# EAGLE design track-testing-rev1 (EAGLE 9.6.2)

## Sheet 1 of 4
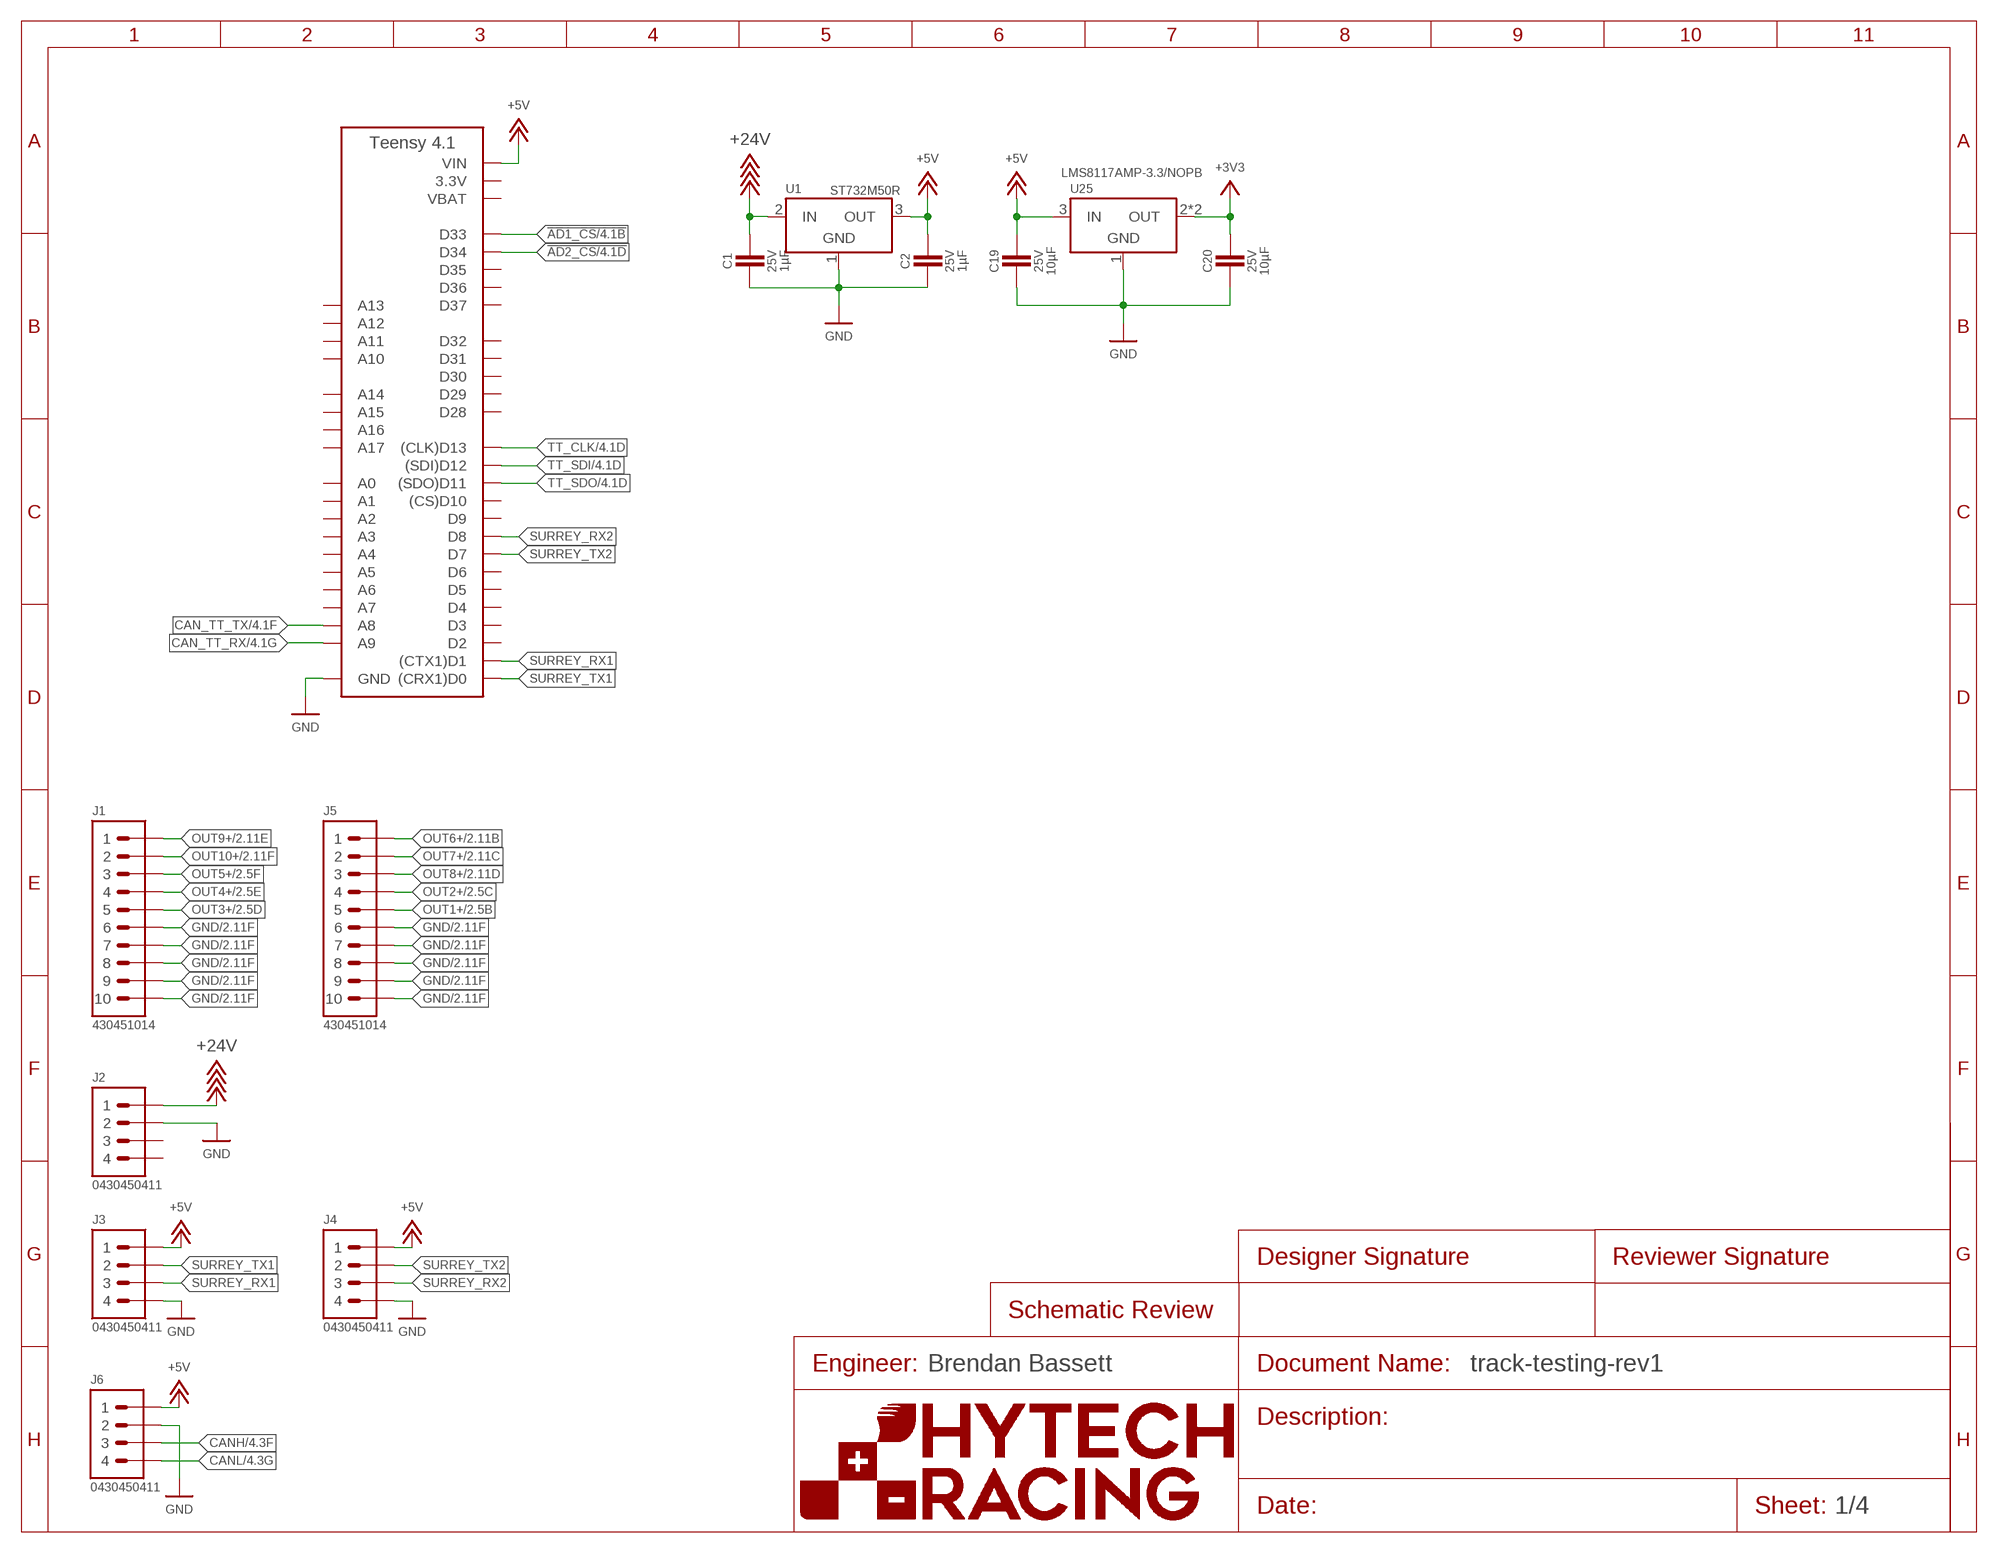
[diagram p0: schematic, sheet 1]
U$6 (FRAME_SCHEMATIC_ONLY): ENGINEER: Brendan Bassett

### Parts
A1  TEENSY_4.1  [TEENSY_LONG_EXT]
C1  CAPACITOR_0603_25V_1UF  [0603-CAP]
C2  CAPACITOR_0603_25V_1UF  [0603-CAP]
C19  CAPACITOR_0603_25V_10UF  [0603-CAP]
C20  CAPACITOR_0603_25V_10UF  [0603-CAP]
J1  CONNECTOR-10_MF_T_V_  [MOLEX_MICROFIT_PTH_VERTICAL_10_DUAL]
J2  CONNECTOR-4_μF_S_RA_  [MOLEX_MICROFIT_SMD_RIGHTANGLE_04_DUAL]
J3  CONNECTOR-4_μF_S_RA_  [MOLEX_MICROFIT_SMD_RIGHTANGLE_04_DUAL]
J4  CONNECTOR-4_μF_S_RA_  [MOLEX_MICROFIT_SMD_RIGHTANGLE_04_DUAL]
J5  CONNECTOR-10_MF_T_V_  [MOLEX_MICROFIT_PTH_VERTICAL_10_DUAL]
J6  CONNECTOR-4_μF_S_RA_  [MOLEX_MICROFIT_SMD_RIGHTANGLE_04_DUAL]
U1  VOLTAGE_REGULATOR_SOT-23-5_5V  [SOT-23-5]
U25  VOLTAGE_REGULATOR_SOT-223_3.3V  [SOT-223]

### Nets
!AD1_CS: A1.D33 ; also sheet 4
!AD2_CS: A1.D34 ; also sheet 4
+3V3: C20.1 U25.2(OUT) U25.4(OUT) ; also sheet 4
+5V: A1.VIN C2.1 C19.1 J3.1 J4.1 J6.1 U1.3(OUT) U25.3(IN) ; also sheet 2,3,4
+24V: C1.1 J2.1 U1.2(IN)
CAN_TT_RX: A1.D23(A9) ; also sheet 4
CAN_TT_TX: A1.D22(A8) ; also sheet 4
CANH: J6.3 ; also sheet 4
CANL: J6.4 ; also sheet 4
GND: A1.AGND/GND(GND) A1.GND A1.GND@2(GND) C1.2 C2.2 C19.2 C20.2 J1.6 J1.7 J1.8 J1.9 J1.10 J2.2 J3.4 J4.4 J5.6 J5.7 J5.8 J5.9 J5.10 J6.2 U1.1(GND) U25.1(GND) ; also sheet 2,3,4
OUT1+: J5.5 ; also sheet 2
OUT2+: J5.4 ; also sheet 2
OUT3+: J1.5 ; also sheet 2
OUT4+: J1.4 ; also sheet 2
OUT5+: J1.3 ; also sheet 2
OUT6+: J5.1 ; also sheet 2
OUT7+: J5.2 ; also sheet 2
OUT8+: J5.3 ; also sheet 2
OUT9+: J1.1 ; also sheet 2
OUT10+: J1.2 ; also sheet 2
SURREY_RX1: A1.D1((CTX1)D1) J3.3
SURREY_RX2: A1.D8 J4.3
SURREY_TX1: A1.D0((CRX1)D0) J3.2
SURREY_TX2: A1.D7 J4.2
TT_CLK: A1.D13((CLK)D13) ; also sheet 4
TT_SDI: A1.D12((SDI)D12) ; also sheet 4
TT_SDO: A1.D11((SDO)D11) ; also sheet 4
Unconnected: A1.D2 A1.D3 A1.D4 A1.D5 A1.D6 A1.D9 A1.D10((CS)D10) A1.D14(A0) A1.D15(A1) A1.D16(A2) A1.D17(A3) A1.D18(A4) A1.D19(A5) A1.D20(A6) A1.D21(A7) A1.D24(A10) A1.D25(A11) A1.D26(A12) A1.D27(A13) A1.D28 A1.D29 A1.D30 A1.D31 A1.D32 A1.D35 A1.D36 A1.D37 A1.D38(A14) A1.D39(A15) A1.D40(A16) A1.D41(A17) J2.3 J2.4

## Sheet 2 of 4
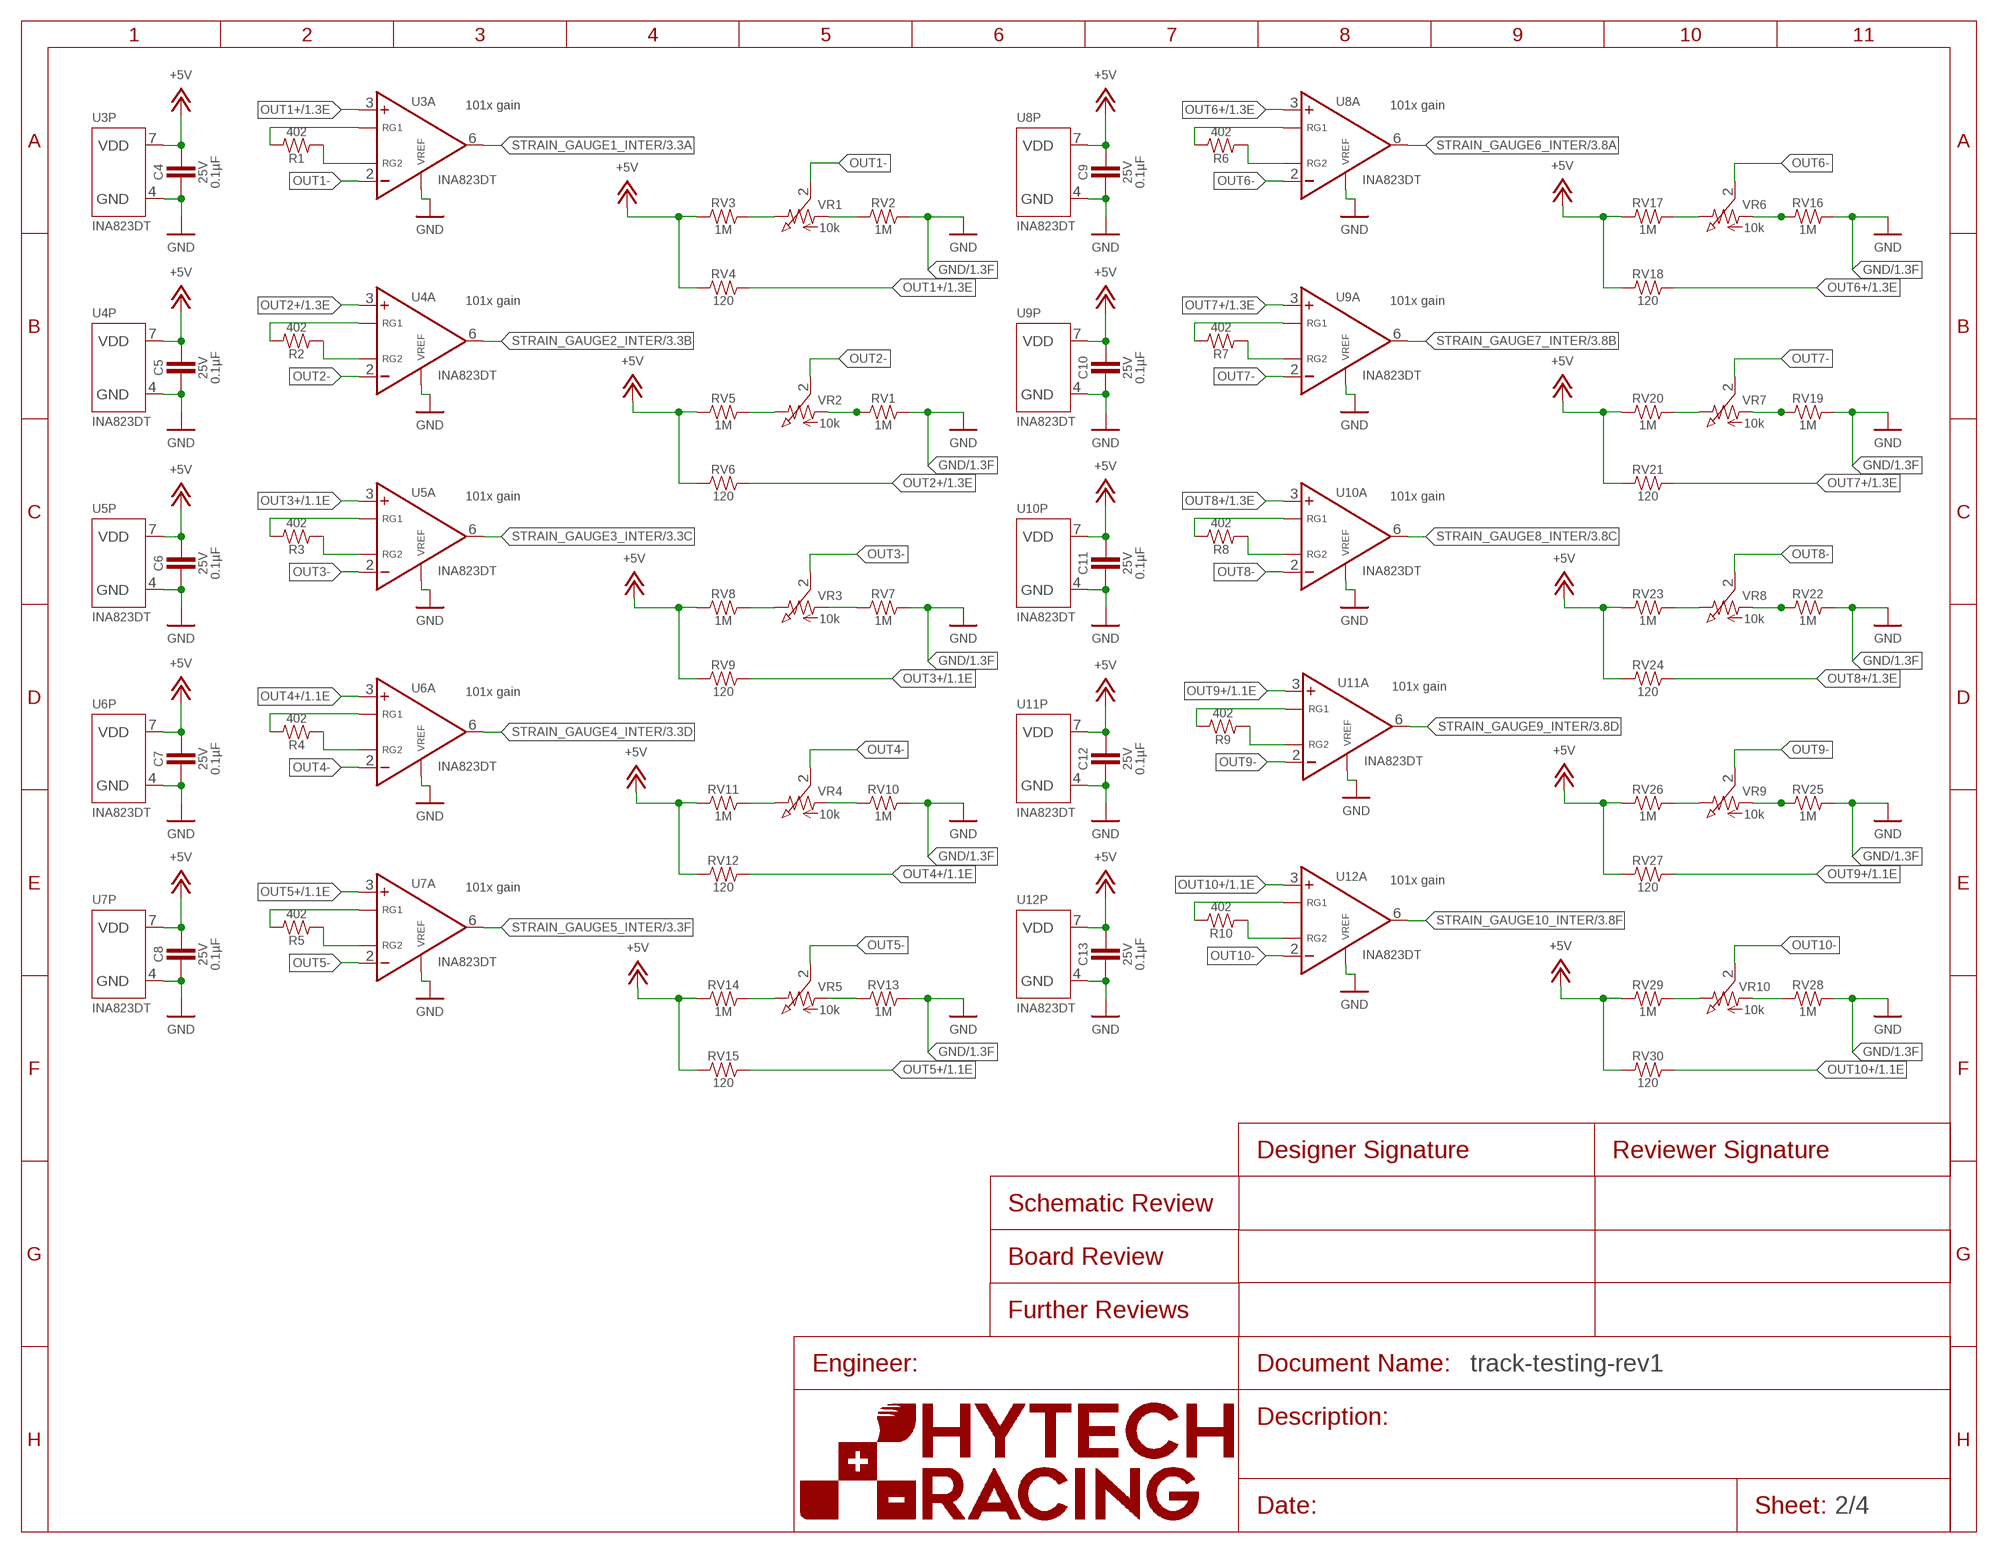
[diagram p1: schematic, sheet 2]

### Parts
C4  CAPACITOR_0603_25V_0.1UF  [0603-CAP]
C5  CAPACITOR_0603_25V_0.1UF  [0603-CAP]
C6  CAPACITOR_0603_25V_0.1UF  [0603-CAP]
C7  CAPACITOR_0603_25V_0.1UF  [0603-CAP]
C8  CAPACITOR_0603_25V_0.1UF  [0603-CAP]
C9  CAPACITOR_0603_25V_0.1UF  [0603-CAP]
C10  CAPACITOR_0603_25V_0.1UF  [0603-CAP]
C11  CAPACITOR_0603_25V_0.1UF  [0603-CAP]
C12  CAPACITOR_0603_25V_0.1UF  [0603-CAP]
C13  CAPACITOR_0603_25V_0.1UF  [0603-CAP]
R1  RESISTOR_0603_402  [0603-RES]
R2  RESISTOR_0603_402  [0603-RES]
R3  RESISTOR_0603_402  [0603-RES]
R4  RESISTOR_0603_402  [0603-RES]
R5  RESISTOR_0603_402  [0603-RES]
R6  RESISTOR_0603_402  [0603-RES]
R7  RESISTOR_0603_402  [0603-RES]
R8  RESISTOR_0603_402  [0603-RES]
R9  RESISTOR_0603_402  [0603-RES]
R10  RESISTOR_0603_402  [0603-RES]
RV1  1M  RESISTOR_0603_1M  [0603-RES]
RV2  1M  RESISTOR_0603_1M  [0603-RES]
RV3  1M  RESISTOR_0603_1M  [0603-RES]
RV4  120  RESISTOR_0603_120  [0603-RES]
RV5  1M  RESISTOR_0603_1M  [0603-RES]
RV6  120  RESISTOR_0603_120  [0603-RES]
RV7  1M  RESISTOR_0603_1M  [0603-RES]
RV8  1M  RESISTOR_0603_1M  [0603-RES]
RV9  120  RESISTOR_VALUE  [0603-RES]
RV10  1M  RESISTOR_0603_1M  [0603-RES]
RV11  1M  RESISTOR_0603_1M  [0603-RES]
RV12  120  RESISTOR_0603_120  [0603-RES]
RV13  1M  RESISTOR_0603_1M  [0603-RES]
RV14  1M  RESISTOR_0603_1M  [0603-RES]
RV15  120  RESISTOR_0603_120  [0603-RES]
RV16  1M  RESISTOR_0603_1M  [0603-RES]
RV17  1M  RESISTOR_0603_1M  [0603-RES]
RV18  120  RESISTOR_0603_120  [0603-RES]
RV19  1M  RESISTOR_0603_1M  [0603-RES]
RV20  1M  RESISTOR_0603_1M  [0603-RES]
RV21  120  RESISTOR_0603_120  [0603-RES]
RV22  1M  RESISTOR_0603_1M  [0603-RES]
RV23  1M  RESISTOR_0603_1M  [0603-RES]
RV24  120  RESISTOR_0603_120  [0603-RES]
RV25  1M  RESISTOR_0603_1M  [0603-RES]
RV26  1M  RESISTOR_0603_1M  [0603-RES]
RV27  120  RESISTOR_0603_120  [0603-RES]
RV28  1M  RESISTOR_0603_1M  [0603-RES]
RV29  1M  RESISTOR_0603_1M  [0603-RES]
RV30  120  RESISTOR_0603_120  [0603-RES]
U3  INA823DT  [SOIC-08(NARROW,0.15")]
U4  INA823DT  [SOIC-08(NARROW,0.15")]
U5  INA823DT  [SOIC-08(NARROW,0.15")]
U6  INA823DT  [SOIC-08(NARROW,0.15")]
U7  INA823DT  [SOIC-08(NARROW,0.15")]
U8  INA823DT  [SOIC-08(NARROW,0.15")]
U9  INA823DT  [SOIC-08(NARROW,0.15")]
U10  INA823DT  [SOIC-08(NARROW,0.15")]
U11  INA823DT  [SOIC-08(NARROW,0.15")]
U12  INA823DT  [SOIC-08(NARROW,0.15")]
VR1  RESISTOR_TRIMPOT_10K_3362P  [3362P]
VR2  RESISTOR_TRIMPOT_10K_3362P  [3362P]
VR3  RESISTOR_TRIMPOT_10K_3362P  [3362P]
VR4  RESISTOR_TRIMPOT_10K_3362P  [3362P]
VR5  RESISTOR_TRIMPOT_10K_3362P  [3362P]
VR6  RESISTOR_TRIMPOT_10K_3362P  [3362P]
VR7  RESISTOR_TRIMPOT_10K_3362P  [3362P]
VR8  RESISTOR_TRIMPOT_10K_3362P  [3362P]
VR9  RESISTOR_TRIMPOT_10K_3362P  [3362P]
VR10  RESISTOR_TRIMPOT_10K_3362P  [3362P]

### Nets
+5V: C4.1 C5.1 C6.1 C7.1 C8.1 C9.1 C10.1 C11.1 C12.1 C13.1 RV3.1 RV4.1 RV5.1 RV6.1 RV8.1 RV9.1 RV11.1 RV12.1 RV14.1 RV15.1 RV17.1 RV18.1 RV20.1 RV21.1 RV23.1 RV24.1 RV26.1 RV27.1 RV29.1 RV30.1 U3.7(P:VDD) U4.7(P:VDD) U5.7(P:VDD) U6.7(P:VDD) U7.7(P:VDD) U8.7(P:VDD) U9.7(P:VDD) U10.7(P:VDD) U11.7(P:VDD) U12.7(P:VDD) ; also sheet 1,3,4
GND: C4.2 C5.2 C6.2 C7.2 C8.2 C9.2 C10.2 C11.2 C12.2 C13.2 RV1.2 RV2.2 RV7.2 RV10.2 RV13.2 RV16.2 RV19.2 RV22.2 RV25.2 RV28.2 U3.4(P:GND) U3.5(A:VREF) U4.4(P:GND) U4.5(A:VREF) U5.4(P:GND) U5.5(A:VREF) U6.4(P:GND) U6.5(A:VREF) U7.4(P:GND) U7.5(A:VREF) U8.4(P:GND) U8.5(A:VREF) U9.4(P:GND) U9.5(A:VREF) U10.4(P:GND) U10.5(A:VREF) U11.4(P:GND) U11.5(A:VREF) U12.4(P:GND) U12.5(A:VREF) ; also sheet 1,3,4
N$1: R2.2 U4.1(A:RG1)
N$2: R1.2 U3.1(A:RG1)
N$3: R1.1 U3.8(A:RG2)
N$4: R2.1 U4.8(A:RG2)
N$5: R3.2 U5.1(A:RG1)
N$6: R6.2 U8.1(A:RG1)
N$7: R3.1 U5.8(A:RG2)
N$8: R6.1 U8.8(A:RG2)
N$9: R4.2 U6.1(A:RG1)
N$10: R7.2 U9.1(A:RG1)
N$11: R4.1 U6.8(A:RG2)
N$12: R5.2 U7.1(A:RG1)
N$13: R5.1 U7.8(A:RG2)
N$14: R7.1 U9.8(A:RG2)
N$15: R8.2 U10.1(A:RG1)
N$16: R8.1 U10.8(A:RG2)
N$17: R9.2 U11.1(A:RG1)
N$18: R9.1 U11.8(A:RG2)
N$19: R10.2 U12.1(A:RG1)
N$20: R10.1 U12.8(A:RG2)
N$41: RV2.1 VR1.1
N$42: RV3.2 VR1.3
N$44: RV1.1 VR2.1
N$45: RV5.2 VR2.3
N$46: RV11.2 VR4.3
N$47: RV7.1 VR3.1
N$48: RV8.2 VR3.3
N$49: RV10.1 VR4.1
N$50: RV14.2 VR5.3
N$51: RV13.1 VR5.1
N$52: RV16.1 VR6.1
N$53: RV17.2 VR6.3
N$54: RV19.1 VR7.1
N$55: RV20.2 VR7.3
N$56: RV22.1 VR8.1
N$57: RV23.2 VR8.3
N$58: RV25.1 VR9.1
N$59: RV26.2 VR9.3
N$60: RV28.1 VR10.1
N$61: RV29.2 VR10.3
OUT1+: RV4.2 U3.3(A:VIN+) ; also sheet 1
OUT1-: U3.2(A:VIN-) VR1.2
OUT2+: RV6.2 U4.3(A:VIN+) ; also sheet 1
OUT2-: U4.2(A:VIN-) VR2.2
OUT3+: RV9.2 U5.3(A:VIN+) ; also sheet 1
OUT3-: U5.2(A:VIN-) VR3.2
OUT4+: RV12.2 U6.3(A:VIN+) ; also sheet 1
OUT4-: U6.2(A:VIN-) VR4.2
OUT5+: RV15.2 U7.3(A:VIN+) ; also sheet 1
OUT5-: U7.2(A:VIN-) VR5.2
OUT6+: RV18.2 U8.3(A:VIN+) ; also sheet 1
OUT6-: U8.2(A:VIN-) VR6.2
OUT7+: RV21.2 U9.3(A:VIN+) ; also sheet 1
OUT7-: U9.2(A:VIN-) VR7.2
OUT8+: RV24.2 U10.3(A:VIN+) ; also sheet 1
OUT8-: U10.2(A:VIN-) VR8.2
OUT9+: RV27.2 U11.3(A:VIN+) ; also sheet 1
OUT9-: U11.2(A:VIN-) VR9.2
OUT10+: RV30.2 U12.3(A:VIN+) ; also sheet 1
OUT10-: U12.2(A:VIN-) VR10.2
STRAIN_GAUGE1_INTER: U3.6(A:VOUT) ; also sheet 3
STRAIN_GAUGE2_INTER: U4.6(A:VOUT) ; also sheet 3
STRAIN_GAUGE3_INTER: U5.6(A:VOUT) ; also sheet 3
STRAIN_GAUGE4_INTER: U6.6(A:VOUT) ; also sheet 3
STRAIN_GAUGE5_INTER: U7.6(A:VOUT) ; also sheet 3
STRAIN_GAUGE6_INTER: U8.6(A:VOUT) ; also sheet 3
STRAIN_GAUGE7_INTER: U9.6(A:VOUT) ; also sheet 3
STRAIN_GAUGE8_INTER: U10.6(A:VOUT) ; also sheet 3
STRAIN_GAUGE9_INTER: U11.6(A:VOUT) ; also sheet 3
STRAIN_GAUGE10_INTER: U12.6(A:VOUT) ; also sheet 3

### Notes on the sheet
- 101x gain | 101x gain
- 101x gain | 101x gain
- 101x gain | 101x gain
- 101x gain
- 101x gain
- 101x gain
- 101x gain

## Sheet 3 of 4
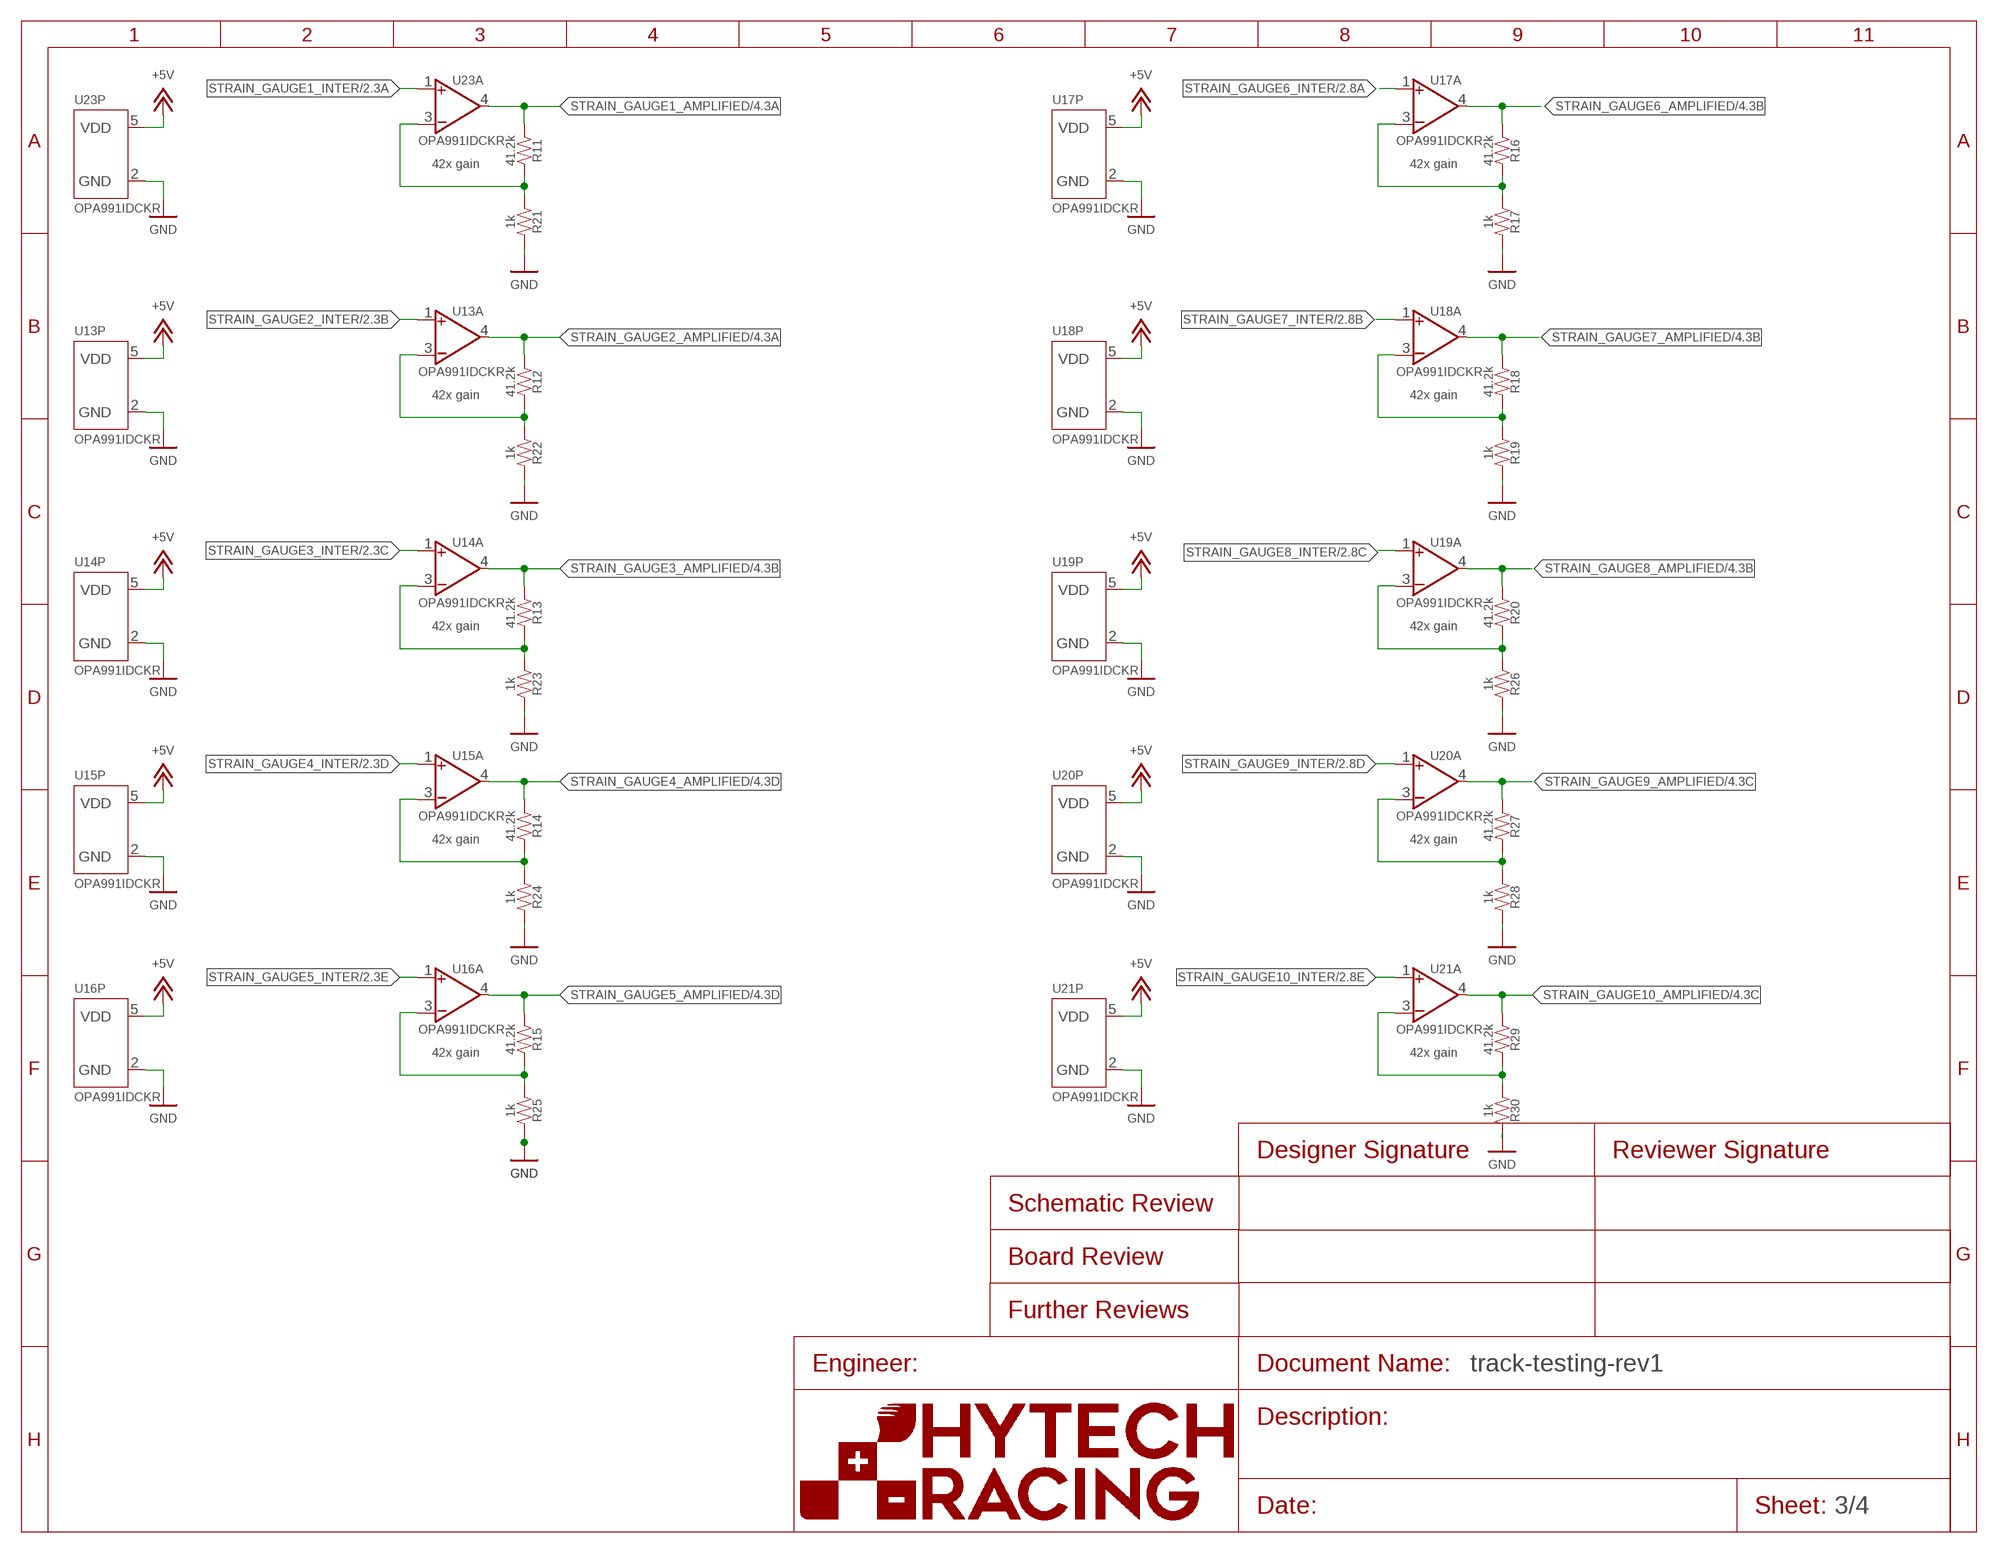
[diagram p2: schematic, sheet 3]

### Parts
R11  RESISTOR_0603_41.2K  [0603-RES]
R12  RESISTOR_0603_41.2K  [0603-RES]
R13  RESISTOR_0603_41.2K  [0603-RES]
R14  RESISTOR_0603_41.2K  [0603-RES]
R15  RESISTOR_0603_41.2K  [0603-RES]
R16  RESISTOR_0603_41.2K  [0603-RES]
R17  RESISTOR_0603_1K  [0603-RES]
R18  RESISTOR_0603_41.2K  [0603-RES]
R19  RESISTOR_0603_1K  [0603-RES]
R20  RESISTOR_0603_41.2K  [0603-RES]
R21  RESISTOR_0603_1K  [0603-RES]
R22  RESISTOR_0603_1K  [0603-RES]
R23  RESISTOR_0603_1K  [0603-RES]
R24  RESISTOR_0603_1K  [0603-RES]
R25  RESISTOR_0603_1K  [0603-RES]
R26  RESISTOR_0603_1K  [0603-RES]
R27  RESISTOR_0603_41.2K  [0603-RES]
R28  RESISTOR_0603_1K  [0603-RES]
R29  RESISTOR_0603_41.2K  [0603-RES]
R30  RESISTOR_0603_1K  [0603-RES]
U13  OPAMP_1_CHANNEL_OPA991  [SC-70-5]
U14  OPAMP_1_CHANNEL_OPA991  [SC-70-5]
U15  OPAMP_1_CHANNEL_OPA991  [SC-70-5]
U16  OPAMP_1_CHANNEL_OPA991  [SC-70-5]
U17  OPAMP_1_CHANNEL_OPA991  [SC-70-5]
U18  OPAMP_1_CHANNEL_OPA991  [SC-70-5]
U19  OPAMP_1_CHANNEL_OPA991  [SC-70-5]
U20  OPAMP_1_CHANNEL_OPA991  [SC-70-5]
U21  OPAMP_1_CHANNEL_OPA991  [SC-70-5]
U23  OPAMP_1_CHANNEL_OPA991  [SC-70-5]

### Nets
+5V: U13.5(P:VDD) U14.5(P:VDD) U15.5(P:VDD) U16.5(P:VDD) U17.5(P:VDD) U18.5(P:VDD) U19.5(P:VDD) U20.5(P:VDD) U21.5(P:VDD) U23.5(P:VDD) ; also sheet 1,2,4
GND: R17.2 R19.2 R21.2 R22.2 R23.2 R24.2 R25.2 R26.2 R28.2 R30.2 U13.2(P:GND) U14.2(P:GND) U15.2(P:GND) U16.2(P:GND) U17.2(P:GND) U18.2(P:GND) U19.2(P:GND) U20.2(P:GND) U21.2(P:GND) U23.2(P:GND) ; also sheet 1,2,4
N$21: R12.2 R22.1 U13.3(A:VIN-)
N$22: R11.2 R21.1 U23.3(A:VIN-)
N$23: R13.2 R23.1 U14.3(A:VIN-)
N$24: R14.2 R24.1 U15.3(A:VIN-)
N$25: R15.2 R25.1 U16.3(A:VIN-)
N$26: R16.2 R17.1 U17.3(A:VIN-)
N$27: R18.2 R19.1 U18.3(A:VIN-)
N$28: R20.2 R26.1 U19.3(A:VIN-)
N$29: R27.2 R28.1 U20.3(A:VIN-)
N$30: R29.2 R30.1 U21.3(A:VIN-)
STRAIN_GAUGE1_AMPLIFIED: R11.1 U23.4(A:VOUT) ; also sheet 4
STRAIN_GAUGE1_INTER: U23.1(A:VIN+) ; also sheet 2
STRAIN_GAUGE2_AMPLIFIED: R12.1 U13.4(A:VOUT) ; also sheet 4
STRAIN_GAUGE2_INTER: U13.1(A:VIN+) ; also sheet 2
STRAIN_GAUGE3_AMPLIFIED: R13.1 U14.4(A:VOUT) ; also sheet 4
STRAIN_GAUGE3_INTER: U14.1(A:VIN+) ; also sheet 2
STRAIN_GAUGE4_AMPLIFIED: R14.1 U15.4(A:VOUT) ; also sheet 4
STRAIN_GAUGE4_INTER: U15.1(A:VIN+) ; also sheet 2
STRAIN_GAUGE5_AMPLIFIED: R15.1 U16.4(A:VOUT) ; also sheet 4
STRAIN_GAUGE5_INTER: U16.1(A:VIN+) ; also sheet 2
STRAIN_GAUGE6_AMPLIFIED: R16.1 U17.4(A:VOUT) ; also sheet 4
STRAIN_GAUGE6_INTER: U17.1(A:VIN+) ; also sheet 2
STRAIN_GAUGE7_AMPLIFIED: R18.1 U18.4(A:VOUT) ; also sheet 4
STRAIN_GAUGE7_INTER: U18.1(A:VIN+) ; also sheet 2
STRAIN_GAUGE8_AMPLIFIED: R20.1 U19.4(A:VOUT) ; also sheet 4
STRAIN_GAUGE8_INTER: U19.1(A:VIN+) ; also sheet 2
STRAIN_GAUGE9_AMPLIFIED: R27.1 U20.4(A:VOUT) ; also sheet 4
STRAIN_GAUGE9_INTER: U20.1(A:VIN+) ; also sheet 2
STRAIN_GAUGE10_AMPLIFIED: R29.1 U21.4(A:VOUT) ; also sheet 4
STRAIN_GAUGE10_INTER: U21.1(A:VIN+) ; also sheet 2

### Notes on the sheet
- 42x gain | 42x gain
- 42x gain | 42x gain
- 42x gain | 42x gain
- 42x gain | 42x gain
- 42x gain | 42x gain

## Sheet 4 of 4
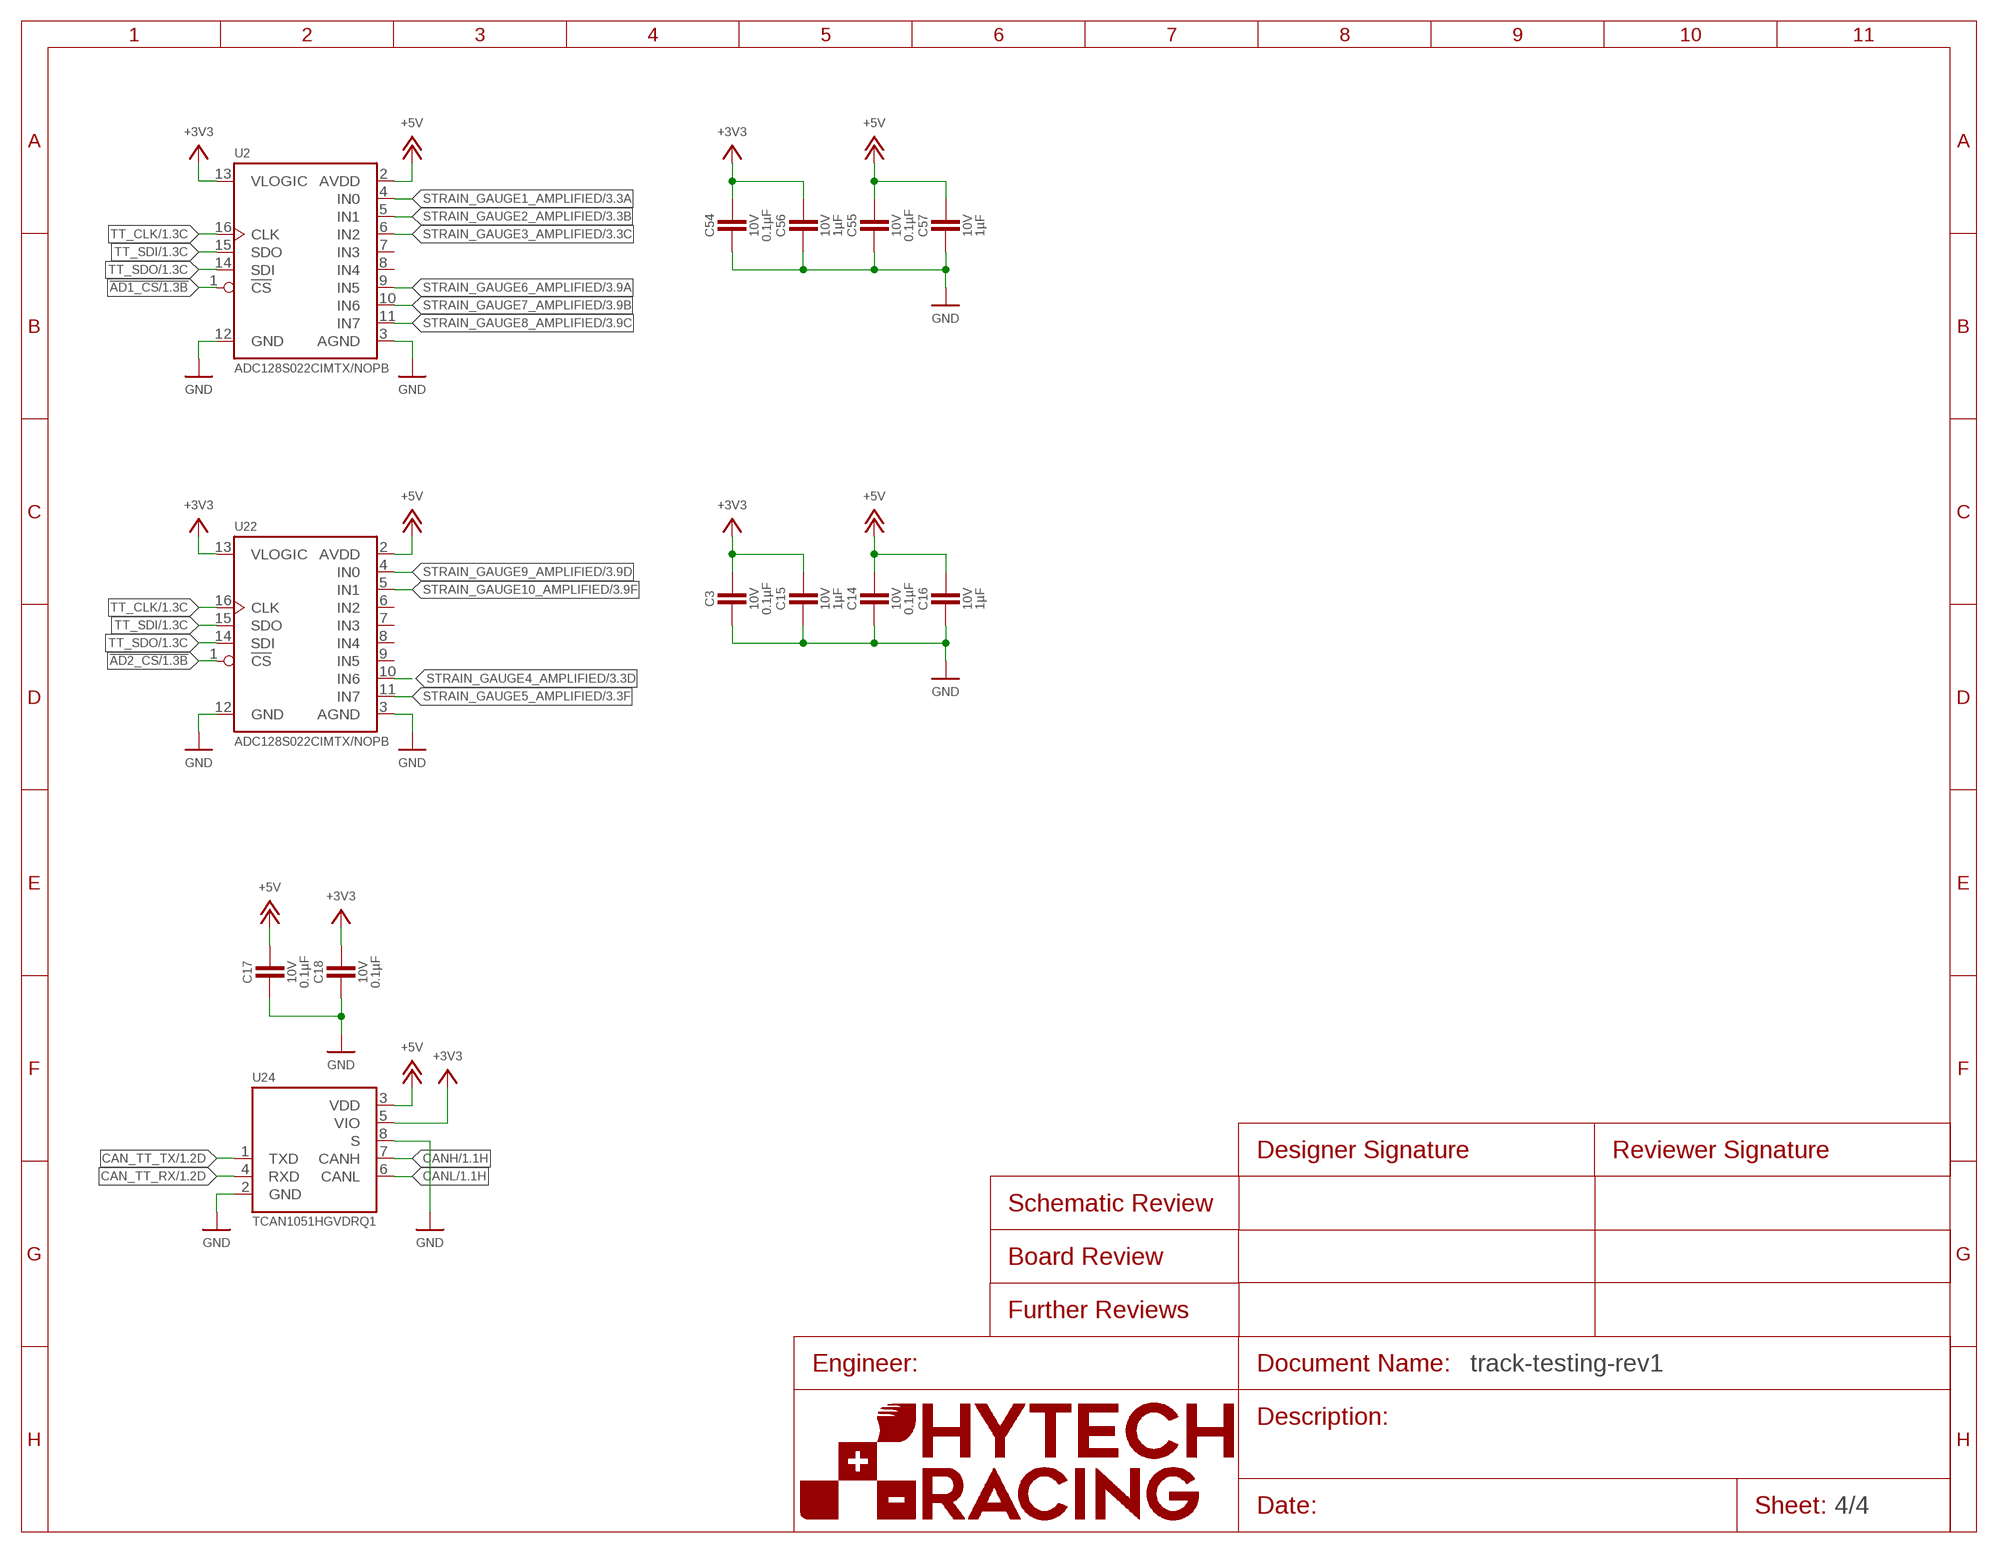
[diagram p3: schematic, sheet 4]

### Parts
C3  CAPACITOR_0603_10V_0.1UF  [0603-CAP]
C14  CAPACITOR_0603_10V_0.1UF  [0603-CAP]
C15  CAPACITOR_0603_10V_1UF  [0603-CAP]
C16  CAPACITOR_0603_10V_1UF  [0603-CAP]
C17  CAPACITOR_0603_10V_0.1UF  [0603-CAP]
C18  CAPACITOR_0603_10V_0.1UF  [0603-CAP]
C54  CAPACITOR_0603_10V_0.1UF  [0603-CAP]
C55  CAPACITOR_0603_10V_0.1UF  [0603-CAP]
C56  CAPACITOR_0603_10V_1UF  [0603-CAP]
C57  CAPACITOR_0603_10V_1UF  [0603-CAP]
U2  ADC128S022  [TSSOP-16]
U22  ADC128S022  [TSSOP-16]
U24  TCAN1051HQV-Q1  [SOIC-08(NARROW,0.15")]

### Nets
!AD1_CS: U2.1(!CS!) ; also sheet 1
!AD2_CS: U22.1(!CS!) ; also sheet 1
+3V3: C3.1 C15.1 C18.1 C54.1 C56.1 U2.13(VLOGIC) U22.13(VLOGIC) U24.5(VIO) ; also sheet 1
+5V: C14.1 C16.1 C17.1 C55.1 C57.1 U2.2(AVDD) U22.2(AVDD) U24.3(VDD) ; also sheet 1,2,3
CAN_TT_RX: U24.4(RXD) ; also sheet 1
CAN_TT_TX: U24.1(TXD) ; also sheet 1
CANH: U24.7(CANH) ; also sheet 1
CANL: U24.6(CANL) ; also sheet 1
GND: C3.2 C14.2 C15.2 C16.2 C17.2 C18.2 C54.2 C55.2 C56.2 C57.2 U2.3(AGND) U2.12(GND) U22.3(AGND) U22.12(GND) U24.2(GND) U24.8(S) ; also sheet 1,2,3
STRAIN_GAUGE1_AMPLIFIED: U2.4(IN0) ; also sheet 3
STRAIN_GAUGE2_AMPLIFIED: U2.5(IN1) ; also sheet 3
STRAIN_GAUGE3_AMPLIFIED: U2.6(IN2) ; also sheet 3
STRAIN_GAUGE4_AMPLIFIED: U22.10(IN6) ; also sheet 3
STRAIN_GAUGE5_AMPLIFIED: U22.11(IN7) ; also sheet 3
STRAIN_GAUGE6_AMPLIFIED: U2.9(IN5) ; also sheet 3
STRAIN_GAUGE7_AMPLIFIED: U2.10(IN6) ; also sheet 3
STRAIN_GAUGE8_AMPLIFIED: U2.11(IN7) ; also sheet 3
STRAIN_GAUGE9_AMPLIFIED: U22.4(IN0) ; also sheet 3
STRAIN_GAUGE10_AMPLIFIED: U22.5(IN1) ; also sheet 3
TT_CLK: U2.16(CLK) U22.16(CLK) ; also sheet 1
TT_SDI: U2.15(SDO) U22.15(SDO) ; also sheet 1
TT_SDO: U2.14(SDI) U22.14(SDI) ; also sheet 1
Unconnected: U2.7(IN3) U2.8(IN4) U22.6(IN2) U22.7(IN3) U22.8(IN4) U22.9(IN5)

## Power pins joined to a net without a drawn wire
3.3V: A1.3V3(3.3V) A1.3V3@2(3.3V) A1.3V3@3(3.3V)
VBAT: A1.VBAT

## Library data of the parts
A1 = HyTechDevices:TEENSY_4.1: Teensy 4.1 with VBAT Datasheet <https://www.pjrc.com/store/teensy41.html#pins> Requires ordering of: 2: 24 pin, 0.1" pitch female headers 1: 2 pin, 0.1" pitch female headers; TEENSY: 4.1
C1 C2 = HyTechDevices:CAPACITOR_?_*: Capacitor, Non-Polarized VJ...1BC Series Datasheet <https://www.mouser.com/datasheet/2/427/vjw1bcbascomseries-1762447.pdf> Samsung Datasheet <https://www.mouser.com/datasheet/2/585/MLCC-1837944.pdf> Walsin Datasheet <https://www.mouser.com/datasheet/2/210/WTC_MLCC_General_Purpose-1534899.pdf> GRM188R61A226ME15D <https://www.mouser.com/datasheet/2/281/1/GRM188R61A226ME15_02A-1985787.pdf> GRM188R61E106MA73D <https://www.mouser.com/datasheet/2/281/1/GRM188R61E106MA73_01A-1985806.pdf> 885012006013 <https://www.mouser.com/datasheet/2/445/885012006013-1726946.pdf> 2220Y6300105KXTWS2 <https://www.mouser.com/datasheet/2/218/SMD_High_and_Std_StackiCap_P62-1825512.pdf> Yageo Class 2, X5R <https://www.mouser.com/datasheet/2/447/UPY_GPHC_X5R_4V_to_50V_26-1827097.pdf> TDK C Series <https://www.mouser.com/ProductDetail/TDK/C3216X5R1V226M160AC?qs=%2Fha2pyFadujbcx9jh7lYl%2F4NeMoXFhdc8AqVWNq4wW6M2y7zl6GzBuhgtI0ngznN> AVX Automotive MLCC <https://www.mouser.com/datasheet/2/40/AutoMLCC-777028.pdf> KEMET X7R Series <https://www.mouser.com/datasheet/2/212/KEM_C1002_X7R_SMD-1102033.pdf> Kyocera AVX <https://www.mouser.com/datasheet/2/40/C0GNP0_Dielectric-951274.pdf> GRM21BR61H <https://www.mouser.com/datasheet/2/281/1/GRM21BR61H106KE43_01A-1986884.pdf>; CAPACITANCE: 1µF; DKPN: 1276-1184-1-ND; MANUFACTURER: Samsung Electro-Mechanics; MOPN: 187-CL10B105KA8NNNC; MPN: CL10B105KA8NNNC; TOLERANCE: 10%; VOLTAGE: 25V
C3 C14 C17 C18 C54 C55 = HyTechDevices:CAPACITOR_?_*: Capacitor, Non-Polarized VJ...1BC Series Datasheet <https://www.mouser.com/datasheet/2/427/vjw1bcbascomseries-1762447.pdf> Samsung Datasheet <https://www.mouser.com/datasheet/2/585/MLCC-1837944.pdf> Walsin Datasheet <https://www.mouser.com/datasheet/2/210/WTC_MLCC_General_Purpose-1534899.pdf> GRM188R61A226ME15D <https://www.mouser.com/datasheet/2/281/1/GRM188R61A226ME15_02A-1985787.pdf> GRM188R61E106MA73D <https://www.mouser.com/datasheet/2/281/1/GRM188R61E106MA73_01A-1985806.pdf> 885012006013 <https://www.mouser.com/datasheet/2/445/885012006013-1726946.pdf> 2220Y6300105KXTWS2 <https://www.mouser.com/datasheet/2/218/SMD_High_and_Std_StackiCap_P62-1825512.pdf> Yageo Class 2, X5R <https://www.mouser.com/datasheet/2/447/UPY_GPHC_X5R_4V_to_50V_26-1827097.pdf> TDK C Series <https://www.mouser.com/ProductDetail/TDK/C3216X5R1V226M160AC?qs=%2Fha2pyFadujbcx9jh7lYl%2F4NeMoXFhdc8AqVWNq4wW6M2y7zl6GzBuhgtI0ngznN> AVX Automotive MLCC <https://www.mouser.com/datasheet/2/40/AutoMLCC-777028.pdf> KEMET X7R Series <https://www.mouser.com/datasheet/2/212/KEM_C1002_X7R_SMD-1102033.pdf> Kyocera AVX <https://www.mouser.com/datasheet/2/40/C0GNP0_Dielectric-951274.pdf> GRM21BR61H <https://www.mouser.com/datasheet/2/281/1/GRM21BR61H106KE43_01A-1986884.pdf>; CAPACITANCE: 0.1µF; DKPN: 720-1688-1-ND; MANUFACTURER: Vishay Vitramon; MOPN: 77-VJ0603Y104JXQPBC; MPN: VJ0603Y104JXQPW1BC; TOLERANCE: 5%; VOLTAGE: 10V
C4-C13 = HyTechDevices:CAPACITOR_?_*: Capacitor, Non-Polarized VJ...1BC Series Datasheet <https://www.mouser.com/datasheet/2/427/vjw1bcbascomseries-1762447.pdf> Samsung Datasheet <https://www.mouser.com/datasheet/2/585/MLCC-1837944.pdf> Walsin Datasheet <https://www.mouser.com/datasheet/2/210/WTC_MLCC_General_Purpose-1534899.pdf> GRM188R61A226ME15D <https://www.mouser.com/datasheet/2/281/1/GRM188R61A226ME15_02A-1985787.pdf> GRM188R61E106MA73D <https://www.mouser.com/datasheet/2/281/1/GRM188R61E106MA73_01A-1985806.pdf> 885012006013 <https://www.mouser.com/datasheet/2/445/885012006013-1726946.pdf> 2220Y6300105KXTWS2 <https://www.mouser.com/datasheet/2/218/SMD_High_and_Std_StackiCap_P62-1825512.pdf> Yageo Class 2, X5R <https://www.mouser.com/datasheet/2/447/UPY_GPHC_X5R_4V_to_50V_26-1827097.pdf> TDK C Series <https://www.mouser.com/ProductDetail/TDK/C3216X5R1V226M160AC?qs=%2Fha2pyFadujbcx9jh7lYl%2F4NeMoXFhdc8AqVWNq4wW6M2y7zl6GzBuhgtI0ngznN> AVX Automotive MLCC <https://www.mouser.com/datasheet/2/40/AutoMLCC-777028.pdf> KEMET X7R Series <https://www.mouser.com/datasheet/2/212/KEM_C1002_X7R_SMD-1102033.pdf> Kyocera AVX <https://www.mouser.com/datasheet/2/40/C0GNP0_Dielectric-951274.pdf> GRM21BR61H <https://www.mouser.com/datasheet/2/281/1/GRM21BR61H106KE43_01A-1986884.pdf>; CAPACITANCE: 0.1µF; DKPN: 1276-1006-1-ND; MANUFACTURER: Samsung Electro-Mechanics; MOPN: 187-CL10B104KA8NNNC; MPN: CL10B104KA8NNNC; TOLERANCE: 10%; VOLTAGE: 25V
C15 C16 C56 C57 = HyTechDevices:CAPACITOR_?_*: Capacitor, Non-Polarized VJ...1BC Series Datasheet <https://www.mouser.com/datasheet/2/427/vjw1bcbascomseries-1762447.pdf> Samsung Datasheet <https://www.mouser.com/datasheet/2/585/MLCC-1837944.pdf> Walsin Datasheet <https://www.mouser.com/datasheet/2/210/WTC_MLCC_General_Purpose-1534899.pdf> GRM188R61A226ME15D <https://www.mouser.com/datasheet/2/281/1/GRM188R61A226ME15_02A-1985787.pdf> GRM188R61E106MA73D <https://www.mouser.com/datasheet/2/281/1/GRM188R61E106MA73_01A-1985806.pdf> 885012006013 <https://www.mouser.com/datasheet/2/445/885012006013-1726946.pdf> 2220Y6300105KXTWS2 <https://www.mouser.com/datasheet/2/218/SMD_High_and_Std_StackiCap_P62-1825512.pdf> Yageo Class 2, X5R <https://www.mouser.com/datasheet/2/447/UPY_GPHC_X5R_4V_to_50V_26-1827097.pdf> TDK C Series <https://www.mouser.com/ProductDetail/TDK/C3216X5R1V226M160AC?qs=%2Fha2pyFadujbcx9jh7lYl%2F4NeMoXFhdc8AqVWNq4wW6M2y7zl6GzBuhgtI0ngznN> AVX Automotive MLCC <https://www.mouser.com/datasheet/2/40/AutoMLCC-777028.pdf> KEMET X7R Series <https://www.mouser.com/datasheet/2/212/KEM_C1002_X7R_SMD-1102033.pdf> Kyocera AVX <https://www.mouser.com/datasheet/2/40/C0GNP0_Dielectric-951274.pdf> GRM21BR61H <https://www.mouser.com/datasheet/2/281/1/GRM21BR61H106KE43_01A-1986884.pdf>; CAPACITANCE: 1µF; DKPN: 311-1796-1-ND; MANUFACTURER: Yageo; MOPN: 603-CC603KRX7R6BB105; MPN: CC0603KRX7R6BB105; TOLERANCE: 10%; VOLTAGE: 10V
C19 C20 = HyTechDevices:CAPACITOR_?_*: Capacitor, Non-Polarized VJ...1BC Series Datasheet <https://www.mouser.com/datasheet/2/427/vjw1bcbascomseries-1762447.pdf> Samsung Datasheet <https://www.mouser.com/datasheet/2/585/MLCC-1837944.pdf> Walsin Datasheet <https://www.mouser.com/datasheet/2/210/WTC_MLCC_General_Purpose-1534899.pdf> GRM188R61A226ME15D <https://www.mouser.com/datasheet/2/281/1/GRM188R61A226ME15_02A-1985787.pdf> GRM188R61E106MA73D <https://www.mouser.com/datasheet/2/281/1/GRM188R61E106MA73_01A-1985806.pdf> 885012006013 <https://www.mouser.com/datasheet/2/445/885012006013-1726946.pdf> 2220Y6300105KXTWS2 <https://www.mouser.com/datasheet/2/218/SMD_High_and_Std_StackiCap_P62-1825512.pdf> Yageo Class 2, X5R <https://www.mouser.com/datasheet/2/447/UPY_GPHC_X5R_4V_to_50V_26-1827097.pdf> TDK C Series <https://www.mouser.com/ProductDetail/TDK/C3216X5R1V226M160AC?qs=%2Fha2pyFadujbcx9jh7lYl%2F4NeMoXFhdc8AqVWNq4wW6M2y7zl6GzBuhgtI0ngznN> AVX Automotive MLCC <https://www.mouser.com/datasheet/2/40/AutoMLCC-777028.pdf> KEMET X7R Series <https://www.mouser.com/datasheet/2/212/KEM_C1002_X7R_SMD-1102033.pdf> Kyocera AVX <https://www.mouser.com/datasheet/2/40/C0GNP0_Dielectric-951274.pdf> GRM21BR61H <https://www.mouser.com/datasheet/2/281/1/GRM21BR61H106KE43_01A-1986884.pdf>; CAPACITANCE: 10µF; DKPN: 490-7202-1-ND; MANUFACTURER: Murata Electronics; MOPN: 81-GRM188R61E106MA3D; MPN: GRM188R61E106MA73D; TOLERANCE: 20%; VOLTAGE: 25V
J1 J5 = HyTechDevices:CONNECTOR-10_?_*: 10 pin connector Datasheet <https://www.mouser.com/datasheet/2/276/0430451014_PCB_HEADERS-143158.pdf>; DKPN: WM1799-ND; MANUFACTURER: MOLEX; MOPN: 538-43045-1014; MPN: 430451014
J2-J4 J6 = HyTechDevices:CONNECTOR-4_?_*: 4 Pin Connector; DKPN: WM1832CT-ND; MANUFACTURER: Molex; MOPN: 538-0430450411; MPN: 0430450411
R1-R10 = HyTechDevices:RESISTOR_?_*: Resistor PWR163 Series <https://www.mouser.com/datasheet/2/54/pwr163-777985.pdf> AC Series <https://www.mouser.com/datasheet/2/447/Yageo_PYu_AC_51_RoHS_L_7_1714230-1874691.pdf> PU Series <https://www.mouser.com/datasheet/2/447/PYu-PU_51_RoHS_L_6-1504619.pdf> ERA Series <https://www.mouser.com/datasheet/2/315/AOA0000C307-1149632.pdf> PWR263 Series <https://www.mouser.com/datasheet/2/54/pwr263s_35-778069.pdf> KTR Series <https://www.mouser.com/datasheet/2/348/ROHM_S_A0011075115_1-2563276.pdf> RC Series <https://www.mouser.com/datasheet/2/447/Yageo_03_18_2021_PYu_RC_Group_51_RoHS_L_11-2199992.pdf> ERJ PB3, PB6 Series <https://www.mouser.com/datasheet/2/315/AOA0000C328-1530132.pdf> ERJ PA2, P03, PA3, P06, P08, P14 Series <https://www.mouser.com/datasheet/2/315/AOA0000C331-1141874.pdf> B20 Series <https://www.ohmite.com/assets/docs/res_200.pdf?r=false> TE Connectivity/Holsworthy RN73 Series <https://www.mouser.com/datasheet/2/418/4/NG_DS_1773270_M-604713.pdf> Vishay Dale D/CRCW e3 <https://www.mouser.com/datasheet/2/427/dcrcwe3-1762152.pdf> Ohmite B20 <https://www.ohmite.com/assets/docs/res_200.pdf?r=false>; DKPN: 311-402HRCT-ND; MANUFACTURER: Yageo; MOPN: 603-RC0603FR-07402RL; MPN: RC0603FR-07402RL; POWER: 0.1W; RESISTANCE: 402; TOLERANCE: 1%; VOLTAGE_CONTINUOUS: 6.34V; VOLTAGE_MAX: 75V
R11-R16 R18 R20 R27 R29 = HyTechDevices:RESISTOR_?_*: Resistor PWR163 Series <https://www.mouser.com/datasheet/2/54/pwr163-777985.pdf> AC Series <https://www.mouser.com/datasheet/2/447/Yageo_PYu_AC_51_RoHS_L_7_1714230-1874691.pdf> PU Series <https://www.mouser.com/datasheet/2/447/PYu-PU_51_RoHS_L_6-1504619.pdf> ERA Series <https://www.mouser.com/datasheet/2/315/AOA0000C307-1149632.pdf> PWR263 Series <https://www.mouser.com/datasheet/2/54/pwr263s_35-778069.pdf> KTR Series <https://www.mouser.com/datasheet/2/348/ROHM_S_A0011075115_1-2563276.pdf> RC Series <https://www.mouser.com/datasheet/2/447/Yageo_03_18_2021_PYu_RC_Group_51_RoHS_L_11-2199992.pdf> ERJ PB3, PB6 Series <https://www.mouser.com/datasheet/2/315/AOA0000C328-1530132.pdf> ERJ PA2, P03, PA3, P06, P08, P14 Series <https://www.mouser.com/datasheet/2/315/AOA0000C331-1141874.pdf> B20 Series <https://www.ohmite.com/assets/docs/res_200.pdf?r=false> TE Connectivity/Holsworthy RN73 Series <https://www.mouser.com/datasheet/2/418/4/NG_DS_1773270_M-604713.pdf> Vishay Dale D/CRCW e3 <https://www.mouser.com/datasheet/2/427/dcrcwe3-1762152.pdf> Ohmite B20 <https://www.ohmite.com/assets/docs/res_200.pdf?r=false>; DKPN: P20155CT-ND; MANUFACTURER: Panasonic Electronic Components; MOPN: 667-ERJ-PB3B4122V; MPN: ERJ-PB3B4122V; POWER: 0.2W; RESISTANCE: 41.2k; TOLERANCE: 0.1%; VOLTAGE_CONTINUOUS: 150V; VOLTAGE_MAX: 200V
R17 R19 R21-R26 R28 R30 = HyTechDevices:RESISTOR_?_*: Resistor PWR163 Series <https://www.mouser.com/datasheet/2/54/pwr163-777985.pdf> AC Series <https://www.mouser.com/datasheet/2/447/Yageo_PYu_AC_51_RoHS_L_7_1714230-1874691.pdf> PU Series <https://www.mouser.com/datasheet/2/447/PYu-PU_51_RoHS_L_6-1504619.pdf> ERA Series <https://www.mouser.com/datasheet/2/315/AOA0000C307-1149632.pdf> PWR263 Series <https://www.mouser.com/datasheet/2/54/pwr263s_35-778069.pdf> KTR Series <https://www.mouser.com/datasheet/2/348/ROHM_S_A0011075115_1-2563276.pdf> RC Series <https://www.mouser.com/datasheet/2/447/Yageo_03_18_2021_PYu_RC_Group_51_RoHS_L_11-2199992.pdf> ERJ PB3, PB6 Series <https://www.mouser.com/datasheet/2/315/AOA0000C328-1530132.pdf> ERJ PA2, P03, PA3, P06, P08, P14 Series <https://www.mouser.com/datasheet/2/315/AOA0000C331-1141874.pdf> B20 Series <https://www.ohmite.com/assets/docs/res_200.pdf?r=false> TE Connectivity/Holsworthy RN73 Series <https://www.mouser.com/datasheet/2/418/4/NG_DS_1773270_M-604713.pdf> Vishay Dale D/CRCW e3 <https://www.mouser.com/datasheet/2/427/dcrcwe3-1762152.pdf> Ohmite B20 <https://www.ohmite.com/assets/docs/res_200.pdf?r=false>; DKPN: 1712-CPF-A-0603B1K0ETR-ND; MANUFACTURER: TE Connectivity Passive Product; MOPN: 279-CPF-A-0603B1K0E; MPN: CPF-A-0603B1K0E; POWER: 0.0625W; RESISTANCE: 1k; TOLERANCE: 0.1%; VOLTAGE_CONTINUOUS: 7.9V; VOLTAGE_MAX: 50V
RV1 RV2 RV7 RV10 RV13 RV16 RV19 RV22 RV25 RV28 = HyTechDevices:RESISTOR_?_*: Resistor PWR163 Series <https://www.mouser.com/datasheet/2/54/pwr163-777985.pdf> AC Series <https://www.mouser.com/datasheet/2/447/Yageo_PYu_AC_51_RoHS_L_7_1714230-1874691.pdf> PU Series <https://www.mouser.com/datasheet/2/447/PYu-PU_51_RoHS_L_6-1504619.pdf> ERA Series <https://www.mouser.com/datasheet/2/315/AOA0000C307-1149632.pdf> PWR263 Series <https://www.mouser.com/datasheet/2/54/pwr263s_35-778069.pdf> KTR Series <https://www.mouser.com/datasheet/2/348/ROHM_S_A0011075115_1-2563276.pdf> RC Series <https://www.mouser.com/datasheet/2/447/Yageo_03_18_2021_PYu_RC_Group_51_RoHS_L_11-2199992.pdf> ERJ PB3, PB6 Series <https://www.mouser.com/datasheet/2/315/AOA0000C328-1530132.pdf> ERJ PA2, P03, PA3, P06, P08, P14 Series <https://www.mouser.com/datasheet/2/315/AOA0000C331-1141874.pdf> B20 Series <https://www.ohmite.com/assets/docs/res_200.pdf?r=false> TE Connectivity/Holsworthy RN73 Series <https://www.mouser.com/datasheet/2/418/4/NG_DS_1773270_M-604713.pdf> Vishay Dale D/CRCW e3 <https://www.mouser.com/datasheet/2/427/dcrcwe3-1762152.pdf> Ohmite B20 <https://www.ohmite.com/assets/docs/res_200.pdf?r=false>; 10KOHM: https://www.digikey.com/en/products/detail/yageo/RT0603BRD0710KL/1072198; DKPN: 311-1.00MHRCT-ND; MANUFACTURER: Yageo; MOPN: 603-RC0603FR-071ML; MPN: RC0603FR-071ML; POWER: 0.1W; RESISTANCE: 1M; TOLERANCE: 1%; VOLTAGE_CONTINUOUS: 75V; VOLTAGE_MAX: 75V
RV3 RV5 RV8 RV11 RV14 RV17 RV20 RV23 RV26 RV29 = HyTechDevices:RESISTOR_?_*: Resistor PWR163 Series <https://www.mouser.com/datasheet/2/54/pwr163-777985.pdf> AC Series <https://www.mouser.com/datasheet/2/447/Yageo_PYu_AC_51_RoHS_L_7_1714230-1874691.pdf> PU Series <https://www.mouser.com/datasheet/2/447/PYu-PU_51_RoHS_L_6-1504619.pdf> ERA Series <https://www.mouser.com/datasheet/2/315/AOA0000C307-1149632.pdf> PWR263 Series <https://www.mouser.com/datasheet/2/54/pwr263s_35-778069.pdf> KTR Series <https://www.mouser.com/datasheet/2/348/ROHM_S_A0011075115_1-2563276.pdf> RC Series <https://www.mouser.com/datasheet/2/447/Yageo_03_18_2021_PYu_RC_Group_51_RoHS_L_11-2199992.pdf> ERJ PB3, PB6 Series <https://www.mouser.com/datasheet/2/315/AOA0000C328-1530132.pdf> ERJ PA2, P03, PA3, P06, P08, P14 Series <https://www.mouser.com/datasheet/2/315/AOA0000C331-1141874.pdf> B20 Series <https://www.ohmite.com/assets/docs/res_200.pdf?r=false> TE Connectivity/Holsworthy RN73 Series <https://www.mouser.com/datasheet/2/418/4/NG_DS_1773270_M-604713.pdf> Vishay Dale D/CRCW e3 <https://www.mouser.com/datasheet/2/427/dcrcwe3-1762152.pdf> Ohmite B20 <https://www.ohmite.com/assets/docs/res_200.pdf?r=false>; 9880OHM: https://www.digikey.com/en/products/detail/vishay-dale/TNPW06039K88BEEA/4972508; DKPN: 311-1.00MHRCT-ND; MANUFACTURER: Yageo; MOPN: 603-RC0603FR-071ML; MPN: RC0603FR-071ML; POWER: 0.1W; RESISTANCE: 1M; TOLERANCE: 1%; VOLTAGE_CONTINUOUS: 75V; VOLTAGE_MAX: 75V
RV4 RV6 RV12 RV15 RV18 RV21 RV24 RV27 RV30 = HyTechDevices:RESISTOR_?_*: Resistor PWR163 Series <https://www.mouser.com/datasheet/2/54/pwr163-777985.pdf> AC Series <https://www.mouser.com/datasheet/2/447/Yageo_PYu_AC_51_RoHS_L_7_1714230-1874691.pdf> PU Series <https://www.mouser.com/datasheet/2/447/PYu-PU_51_RoHS_L_6-1504619.pdf> ERA Series <https://www.mouser.com/datasheet/2/315/AOA0000C307-1149632.pdf> PWR263 Series <https://www.mouser.com/datasheet/2/54/pwr263s_35-778069.pdf> KTR Series <https://www.mouser.com/datasheet/2/348/ROHM_S_A0011075115_1-2563276.pdf> RC Series <https://www.mouser.com/datasheet/2/447/Yageo_03_18_2021_PYu_RC_Group_51_RoHS_L_11-2199992.pdf> ERJ PB3, PB6 Series <https://www.mouser.com/datasheet/2/315/AOA0000C328-1530132.pdf> ERJ PA2, P03, PA3, P06, P08, P14 Series <https://www.mouser.com/datasheet/2/315/AOA0000C331-1141874.pdf> B20 Series <https://www.ohmite.com/assets/docs/res_200.pdf?r=false> TE Connectivity/Holsworthy RN73 Series <https://www.mouser.com/datasheet/2/418/4/NG_DS_1773270_M-604713.pdf> Vishay Dale D/CRCW e3 <https://www.mouser.com/datasheet/2/427/dcrcwe3-1762152.pdf> Ohmite B20 <https://www.ohmite.com/assets/docs/res_200.pdf?r=false>; 118OHM: https://www.digikey.com/en/products/detail/panasonic-electronic-components/ERA-3AEB1180V/2026664; DKPN: P120DBCT-ND; MANUFACTURER: Panasonic Electronic Components; MOPN: 667-ERA-3AEB121V; MPN: ERA-3AEB121V; POWER: 0.1W; RESISTANCE: 120; TOLERANCE: 0.1%; VOLTAGE_CONTINUOUS: 3.46V; VOLTAGE_MAX: 75V
RV9 = HyTechDevices:RESISTOR_VALUE: Resistor for prototyping circuits; 118OHM: https://www.digikey.com/en/products/detail/panasonic-electronic-components/ERA-3AEB1180V/2026664
U1 = HyTechDevices:VOLTAGE_REGULATOR_?_*: Voltage Regulators LDL1117S50R Datasheet <https://www.mouser.com/datasheet/2/389/dm00366442-1799212.pdf> NCP785AH120T1G <https://www.mouser.com/datasheet/2/308/NCP785A_D-1812704.pdf> LMS8117A Datasheet <https://www.ti.com/lit/ds/symlink/lms8117a.pdf?HQS> ST732M50R Datasheet <https://www.mouser.com/datasheet/2/389/st732-1830546.pdf>; DKPN: 497-ST732M50RTR-ND; MANUFACTURER: STMicroelectronics; MOPN: 511-ST732M50R; MPN: ST732M50R
U2 U22 = HyTechDevices:ADC128S022: ADC128S022 8-channel Analog to Digital Regulator Datasheet <https://www.ti.com/lit/ds/symlink/adc128s022.pdf?ts=1609290895378&ref_url=https%253A%252F%252Fwww.ti.com%252Fproduct%252FADC128S022%253Fqgpn%253Dadc128s022>; DKPN: 296-38561-1-ND; MANUFACTURER: Texas Instruments; MOPN: 926-A128S022CIMTXNPB; MPN: ADC128S022CIMTX/NOPB
U3-U12 = HyTechDevices:INA823*: INA823 Precision, Low-Power, Wide-Supply (2.7-V to 36-V) Instrumentation Amplifier Datasheet <https://www.ti.com/lit/ds/symlink/ina823.pdf?HQS=dis-mous-null-mousermode-dsf-pf-null-wwe&ts=1664732413637&ref_url=https%253A%252F%252Fwww.ti.com%252Fgeneral%252Fdocs%252Fsuppproductinfo.tsp%253FdistId%253D26%2526gotoUrl%253Dhttps%253A%252F%252Fwww.ti.com%252Flit%252Fgpn%252Fina823>; DKPN: 296-INA823DTCT-ND; MANUFACTURER: Texas Instruments; MOPN: 595-INA823DT; MPN: INA823DT
U13-U21 U23 = HyTechDevices:OPAMP_1_CHANNEL_*: Op-Amp 1 Channel OPA991 Datasheet <https://www.ti.com/lit/ds/symlink/opa991.pdf?ts=1615503614502> Note: OPA991 is also a comparator; DKPN: 296-OPA991IDCKRCT-ND; MANUFACTURER: Texas Instruments; MOPN: 595-OPA991IDCKR; MPN: OPA991IDCKR
U24 = HyTechDevices:TCAN1051*V-Q1: TCAN1051*V Can Tranciever Datasheet <https://www.ti.com/lit/ds/symlink/tcan1051hgv-q1.pdf?HQS=dis-mous-null-mousermode-dsf-pf-null-wwe&ts=1610765132518&ref_url=https%253A%252F%252Fwww.mouser.com%252Ff>; DKPN: 296-49935-1-ND; MANUFACTURER: Texas Instruments; MOPN: 595-TCAN1051HGVDQ1; MPN: TCAN1051HGVDRQ1
U25 = HyTechDevices:VOLTAGE_REGULATOR_?_*: Voltage Regulators LDL1117S50R Datasheet <https://www.mouser.com/datasheet/2/389/dm00366442-1799212.pdf> NCP785AH120T1G <https://www.mouser.com/datasheet/2/308/NCP785A_D-1812704.pdf> LMS8117A Datasheet <https://www.ti.com/lit/ds/symlink/lms8117a.pdf?HQS> ST732M50R Datasheet <https://www.mouser.com/datasheet/2/389/st732-1830546.pdf>; DKPN: LMS8117AMP-3.3/NOPBCT-ND; MANUFACTURER: Texas Instruments; MOPN: 926-LMS8117AMP33NOPB; MPN: LMS8117AMP-3.3/NOPB
VR1-VR10 = HyTechDevices:RESISTOR_TRIMPOT_*_?: Variable Resistor Bourns 3362P Datasheet <https://www.mouser.com/datasheet/2/54/3362-776956.pdf>; DKPN: 3362P-103LF-ND; MANUFACTURER: Bourns Inc.; MOPN: 652-3362P-1-103LF; MPN: 3362P-1-103LF; POWER: 0.5W; RESISTANCE: 10k; TOLERANCE: 10%; VOLTAGE: 70.711V

## Board
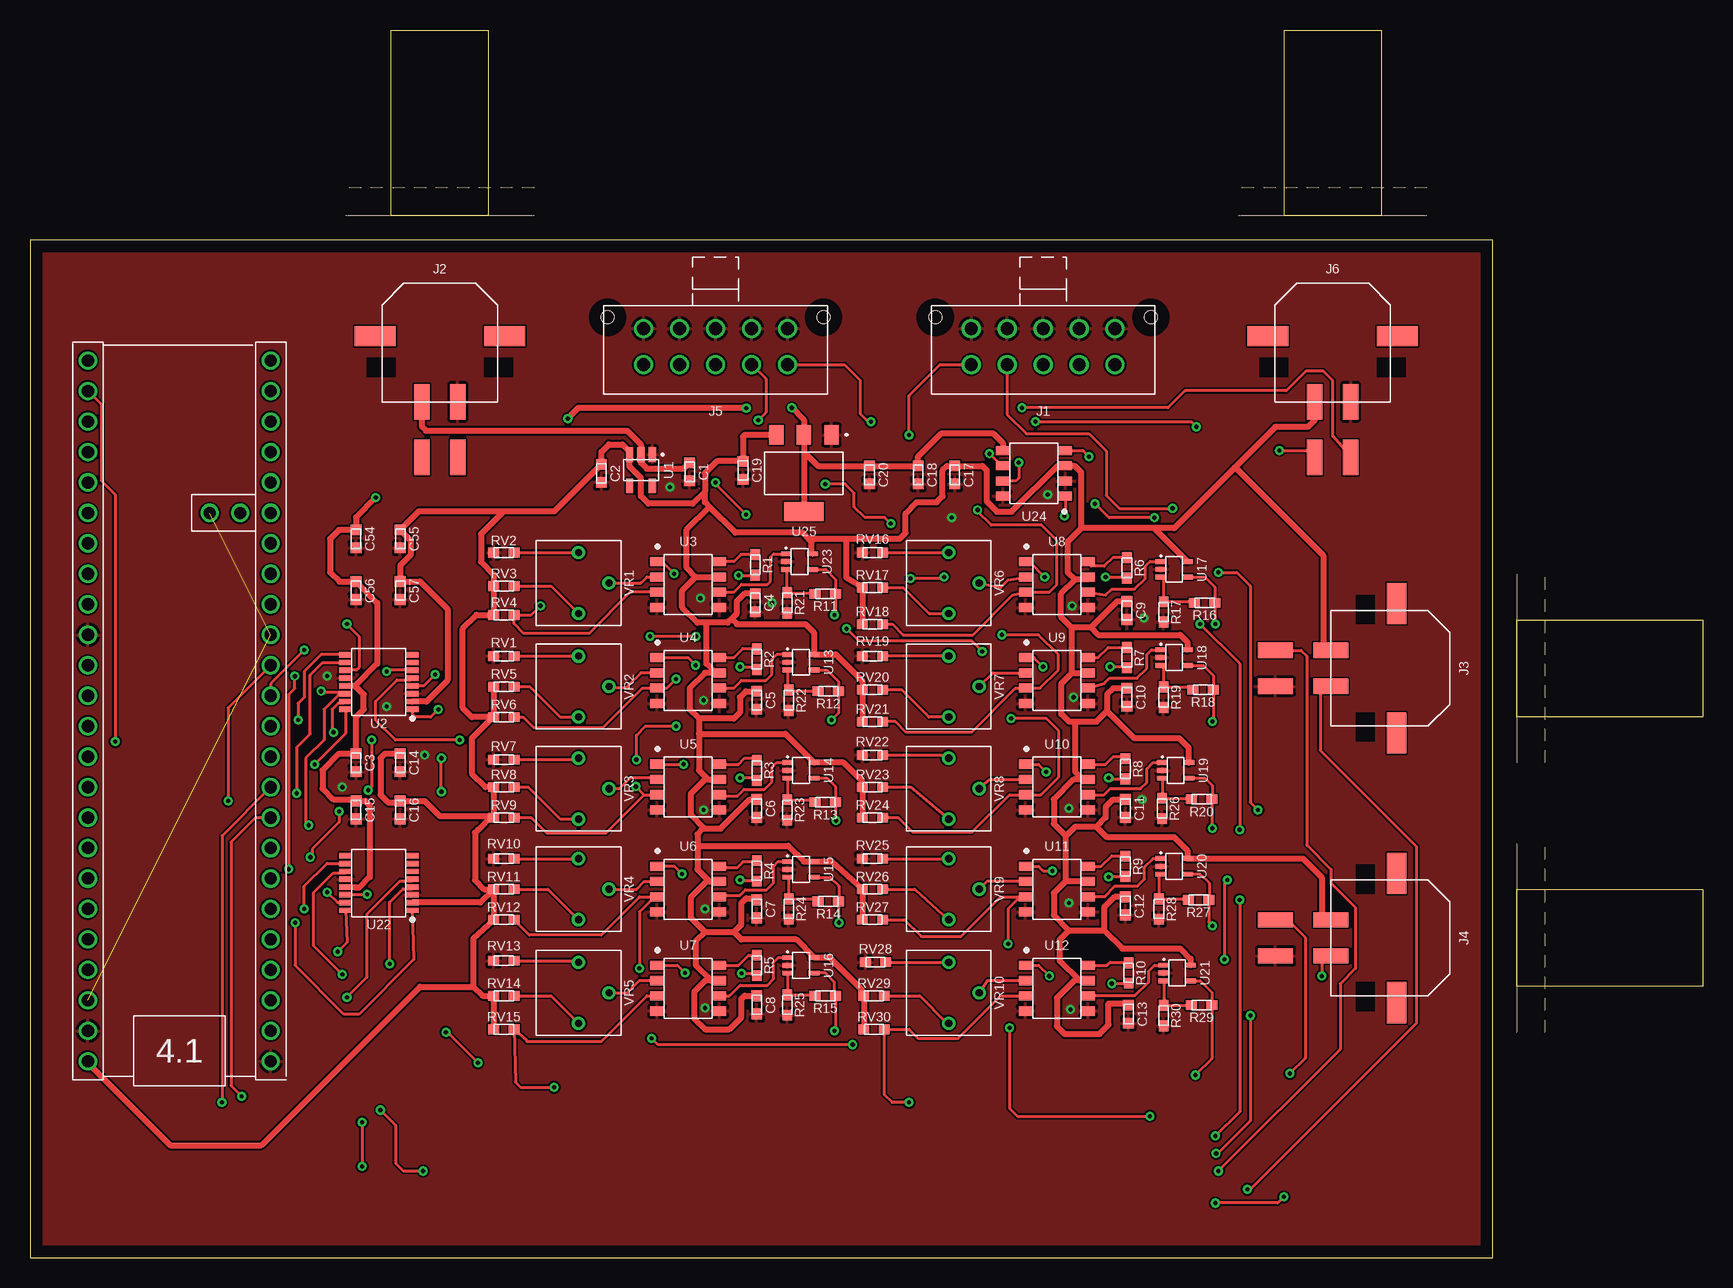
[diagram p4: board, top side]
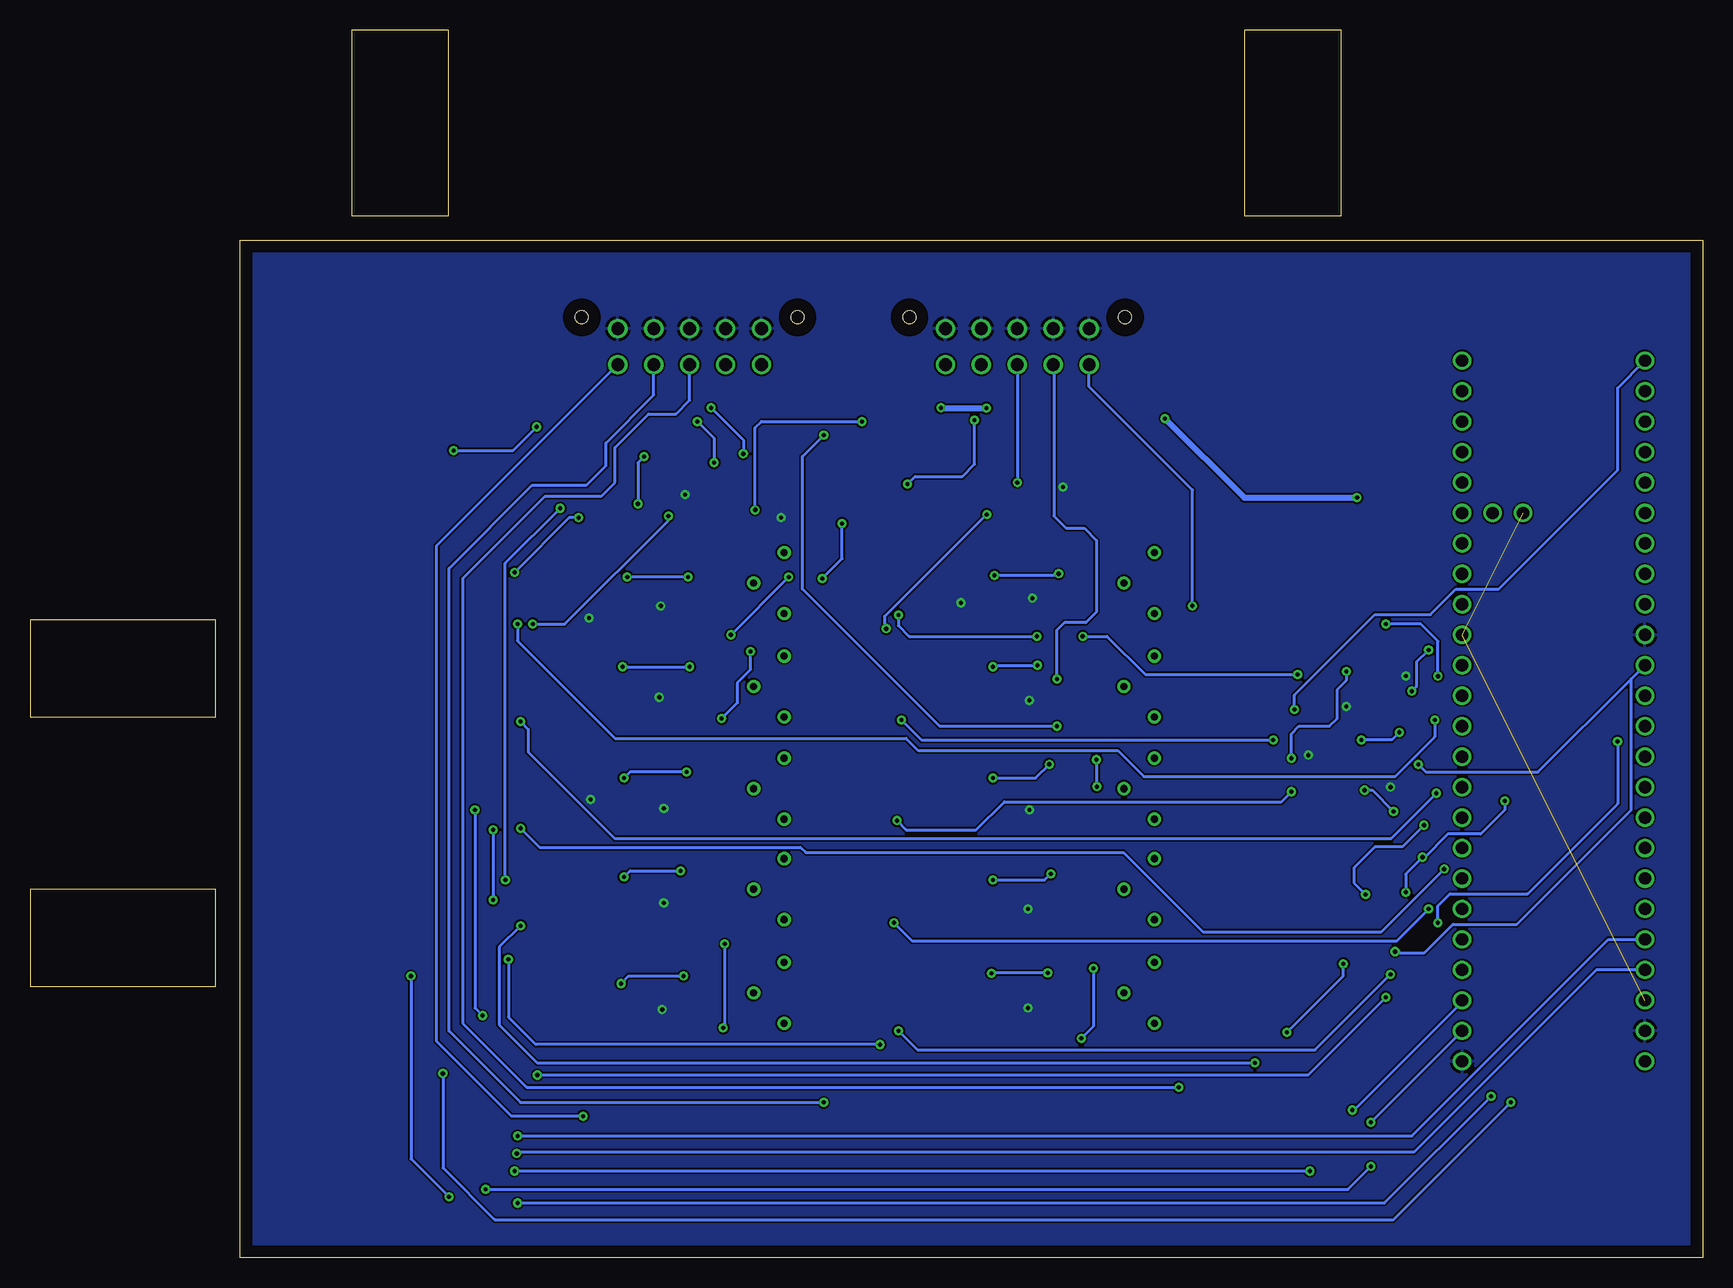
[diagram p5: board, bottom side, seen from below]

Size 121.92 x 84.84 mm. Coordinates in mm from the lower left corner, seen from the top.
Outline: 0,0 121.92,0 121.92,84.84 0,84.84 0,0
Copper layers (1*16): Top 0.035mm / dielectric 1.5mm / Bottom 0.035mm
Design rules "default": minimum track width 6mil, minimum drill 0.35mm, track to track 6mil, track to pad 6mil, pad to pad 6mil, via to via 6mil, smd to smd 6mil, copper to edge 40mil, drill to drill 6mil, minimum pad ring 10mil, minimum via ring 8mil, stop-mask expansion 4mil, vias tented up to drill 0mil, thermal gap 10mil

### Footprints (pad centres in the part's own frame; a part is rotated, then mirrored left to right if it is on the bottom)
TEENSY_LONG_EXT = drill 1.016: 3V3 0,5.08; 3V3@2 15.24,35.56; 3V3@3 10.16,45.72; AGND/GND 0,2.54; D0 15.24,2.54; D1 15.24,5.08; D2 15.24,7.62; D3 15.24,10.16; D4 15.24,12.7; D5 15.24,15.24; D6 15.24,17.78; D7 15.24,20.32; D8 15.24,22.86; D9 15.24,25.4; D10 15.24,27.94; D11 15.24,30.48; D12 15.24,33.02; D13 0,33.02; D14 0,30.48; D15 0,27.94; D16 0,25.4; D17 0,22.86; D18 0,20.32; D19 0,17.78; D20 0,15.24; D21 0,12.7; D22 0,10.16; D23 0,7.62; D24 15.24,38.1; D25 15.24,40.64; D26 15.24,43.18; D27 15.24,45.72; D28 15.24,48.26; D29 15.24,50.8; D30 15.24,53.34; D31 15.24,55.88; D32 15.24,58.42; D33 0,58.42; D34 0,55.88; D35 0,53.34; D36 0,50.8; D37 0,48.26; D38 0,45.72; D39 0,43.18; D40 0,40.64; D41 0,38.1; GND 15.24,0; GND@2 0,35.56; VBAT 12.7,45.72; VIN 0,0
0603-CAP = smd 0.9 x 0.9: 1 -0.75,0; 2 0.75,0
MOLEX_MICROFIT_PTH_VERTICAL_10_DUAL = drill 1.067: 1 5.994,-2.997; 2 2.997,-2.997; 3 0,-2.997; 4 -2.997,-2.997; 5 -5.994,-2.997; 6 5.994,0; 7 2.997,0; 8 0,0; 9 -2.997,0; 10 -5.994,0 | hole 1.067: 8.992,0.94; -8.992,0.94
MOLEX_MICROFIT_SMD_RIGHTANGLE_04_DUAL = smd 1.27 x 2.921: 1 1.5,5.474; 2 -1.5,5.474; 3 1.5,10.097; 4 -1.5,10.097 | smd 3.429 x 1.651: PAD1 5.386,0; PAD2 -5.386,0
0603-RES = smd 0.9 x 0.8: 1 -0.85,0; 2 0.85,0
SOT-23-5 = smd 0.62 x 1.22: 1 -0.95,-1.31; 2 0,-1.31; 3 0.95,-1.31; 4 0.95,1.31; 5 -0.95,1.31
TSSOP-16 = smd 0.45 x 1.05: 1 -2.275,-2.775; 2 -1.625,-2.775; 3 -0.975,-2.775; 4 -0.325,-2.775; 5 0.325,-2.775; 6 0.975,-2.775; 7 1.625,-2.775; 8 2.275,-2.775; 9 2.275,2.775; 10 1.625,2.775; 11 0.975,2.775; 12 0.325,2.775; 13 -0.325,2.775; 14 -0.975,2.775; 15 -1.625,2.775; 16 -2.275,2.775
SOIC-08(NARROW,0.15") = smd 0.762 x 1.143: 1 -1.905,-2.603; 2 -0.635,-2.603; 3 0.635,-2.603; 4 1.905,-2.603; 5 1.905,2.603; 6 0.635,2.603; 7 -0.635,2.603; 8 -1.905,2.603
SC-70-5 = smd 0.4 x 0.9: 1 -0.65,-1.1; 2 0,-1.1; 3 0.65,-1.1; 4 0.65,1.1; 5 -0.65,1.1
SOT-223 = smd 1.2 x 1.6: 1 -2.3,-3.2; 2 0,-3.2; 3 2.3,-3.2 | smd 3.3 x 1.6: 4 0,3.2
3362P = drill 0.6: 1 -2.54,0; 2 0,2.54; 3 2.54,0

### Placement (x,y rotation side)
A1  4.83,16.38 0 top
C1  54.99,65.53 270 top
C2  47.62,65.41 270 top
C3  27.18,41.27 270 top
C4  60.45,54.61 270 top
C5  60.58,46.48 270 top
C6  60.58,37.47 270 top
C7  60.58,29.08 270 top
C8  60.58,21.08 270 top
C9  91.44,53.98 270 top
C10  91.44,46.74 270 top
C11  91.31,37.47 270 top
C12  91.31,29.34 270 top
C13  91.57,20.32 270 top
C14  30.86,41.27 270 top
C15  27.18,37.34 270 top
C16  30.86,37.34 270 top
C17  77.09,65.28 270 top
C18  74.04,65.28 270 top
C19  59.44,65.66 270 top
C20  69.98,65.28 270 top
C54  27.18,59.94 270 top
C55  30.86,59.94 270 top
C56  27.18,55.63 270 top
C57  30.86,55.63 270 top
J1  84.45,77.47 0 top
J2  34.16,76.83 180 top
J3  113.92,49.15 90 top
J4  113.92,26.67 90 top
J5  57.15,77.47 0 top
J6  108.58,76.83 180 top
R1  60.45,57.78 270 top
R2  60.58,49.91 270 top
R3  60.58,40.64 270 top
R4  60.58,32.26 270 top
R5  60.58,24.38 270 top
R6  91.44,57.53 270 top
R7  91.44,50.04 270 top
R8  91.31,40.77 270 top
R9  91.31,32.64 270 top
R10  91.57,23.75 270 top
R11  66.29,55.37 180 top
R12  66.55,47.24 180 top
R13  66.29,37.97 180 top
R14  66.55,29.72 180 top
R15  66.29,21.84 180 top
R16  97.92,54.61 180 top
R17  94.49,53.85 270 top
R18  97.79,47.37 180 top
R19  94.49,46.74 270 top
R20  97.66,38.23 180 top
R21  63.12,54.61 270 top
R22  63.25,46.48 270 top
R23  63.12,37.34 270 top
R24  63.25,29.08 270 top
R25  63.12,21.08 270 top
R26  94.36,37.47 270 top
R27  97.41,29.84 180 top
R28  94.11,29.08 270 top
R29  97.66,21.08 180 top
R30  94.49,20.19 270 top
RV1  39.5,50.16 180 top
RV2  39.5,58.8 180 top
RV3  39.5,56.01 0 top
RV4  39.5,53.59 0 top
RV5  39.5,47.62 0 top
RV6  39.5,45.09 0 top
RV7  39.5,41.53 180 top
RV8  39.5,39.24 0 top
RV9  39.5,36.7 0 top
RV10  39.5,33.27 180 top
RV11  39.5,30.73 0 top
RV12  39.5,28.19 0 top
RV13  39.5,24.77 180 top
RV14  39.5,21.84 0 top
RV15  39.5,19.05 0 top
RV16  70.23,58.8 180 top
RV17  70.23,55.88 0 top
RV18  70.23,52.83 0 top
RV19  70.23,50.16 180 top
RV20  70.23,47.37 0 top
RV21  70.23,44.7 0 top
RV22  70.23,41.91 180 top
RV23  70.23,39.24 0 top
RV24  70.23,36.7 0 top
RV25  70.23,33.27 180 top
RV26  70.23,30.73 0 top
RV27  70.23,28.19 0 top
RV28  70.48,24.64 180 top
RV29  70.36,21.84 0 top
RV30  70.36,19.05 0 top
U1  50.93,65.66 180 top
U2  29.08,48.01 90 top
U3  54.86,56.13 270 top
U4  54.86,48.13 270 top
U5  54.86,39.24 270 top
U6  54.86,30.73 270 top
U7  54.86,22.48 270 top
U8  85.6,56.13 270 top
U9  85.6,48.13 270 top
U10  85.6,39.24 270 top
U11  85.6,30.73 270 top
U12  85.6,22.48 270 top
U13  64.26,49.66 270 top
U14  64.26,40.64 270 top
U15  64.26,32.38 270 top
U16  64.26,24.38 270 top
U17  95.38,57.4 270 top
U18  95.38,50.04 270 top
U19  95.5,40.64 270 top
U20  95.38,32.64 270 top
U21  95.63,23.75 270 top
U22  29.08,31.24 90 top
U23  64.14,58.04 270 top
U24  83.69,65.41 90 top
U25  64.52,65.41 180 top
VR1  45.72,56.26 270 top
VR2  45.72,47.62 270 top
VR3  45.72,39.12 270 top
VR4  45.72,30.73 270 top
VR5  45.72,22.1 270 top
VR6  76.58,56.26 270 top
VR7  76.58,47.62 270 top
VR8  76.58,39.12 270 top
VR9  76.58,30.73 270 top
VR10  76.58,22.1 270 top

### Tracks (layer width: path | path; a pad name or v marks a point on that pad's centre or on a via)
3.3V  (2 unrouted)
!AD1_CS  (via drill 0.35)
  Top 0.254: v34.04,45.72 33.4,45.09 32.12,45.09 31.86,45.35 U2.1
  Bottom 0.254: v34.04,45.72 34.04,46.9 27.32,53.62 22.71,53.62 20.57,55.75 17.02,55.75 7.11,65.66 7.11,72.52 A1.D33
!AD2_CS  (via drill 0.35)
  Top 0.254: U22.1 31.98,24.87 27.43,20.32 26.16,20.32 22.1,24.38 v22.1,27.94 | v7.11,43.05 7.11,63.63 5.97,64.77 5.97,71.12 A1.D34
  Bottom 0.254: v22.1,27.94 22.1,29.34 21.08,30.35 14.61,30.35 7.11,37.85 v7.11,43.05
+3V3  (via drill 0.35)
  Top 0.508: U25.2 64.52,67.18 65.67,66.03 C20.1 C18.1 74.04,66.8 75.95,68.71 80.33,68.71 81.09,67.94 U24.5 | U25.2 U25.4 | v59.71,70.85 45.7,70.85 v44.83,69.98 | v28.83,63.37 27.18,61.72 C54.1 25.77,60.69 25.02,59.94 25.02,57.15 25.79,56.38 C56.1 28.96,54.6 28.96,49.53 27.11,47.68 | U25.2 64.52,69.85 v63.5,70.87 | U22.13 26.45,30.9 27.13,30.9 27.17,30.86 27.43,30.86 28.32,31.75 28.32,37.72 27.94,38.1 26.94,38.1 C15.1 26.79,38.23 25.27,38.23 24.38,39.12 24.38,40.64 25.78,42.04 25.79,42.02 C3.1 27.18,44.96 27.17,45.08 27.81,45.72 27.81,46.98 27.11,47.68 | 27.11,47.68 U2.13
  Bottom 0.508: v44.83,69.98 38.23,63.37 v28.83,63.37 | v59.71,70.85 63.48,70.85 v63.5,70.87
+5V
  Top 0.508: 56.26,63.88 56.26,65.41 57.27,66.41 C19.1 59.44,68.45 59.59,68.61 U25.3 | 56.26,63.88 55.24,62.87 51.56,62.87 50.93,63.5 50.93,65.02 49.98,65.97 U1.3 49.98,67.22 49.38,67.82 48.26,67.82 47.62,67.18 C2.1 43.7,62.23 39.5,62.23 | 39.5,62.23 32.4,62.23 C55.1 30.86,60.67 31.72,59.81 31.72,58.58 30.86,57.72 C57.1 32.5,56.38 32.51,56.39 34.8,54.1 34.8,48.13 33.05,46.38 U2.2 | 39.5,62.23 37.59,60.33 37.59,58.04 38.65,56.98 RV3.1 RV4.1 37.21,53.59 36.07,52.45 36.07,45.85 36.83,45.09 RV6.1 | C4.1 60.44,55.37 59.56,55.37 58.93,54.74 58.93,53.72 58.48,53.28 | 58.48,53.28 58.17,52.96 56.39,52.96 | 56.39,52.96 55.63,52.96 54.36,54.23 54.36,55.63 55.5,56.77 | U23.5 65.15,58.77 65.15,59.69 64.9,59.94 | 64.9,59.94 64.39,60.45 58.8,60.45 56.64,62.61 | 56.64,62.61 56.26,62.99 56.26,63.88 | RV5.1 RV6.1 | RV6.1 38.61,45.09 36.83,43.31 36.83,40.39 37.97,39.24 RV8.1 38.65,36.96 38.52,36.83 | U4.7 57.15,48.77 | 57.15,48.77 56.26,48.77 54.99,47.5 54.99,45.72 55.75,44.96 | C5.1 59.68,47.23 59.18,46.74 59.18,45.47 58.67,44.96 55.75,44.96 | 57.15,48.77 56.39,49.53 56.39,52.96 | 58.48,53.28 58.93,52.83 64.64,52.83 65.34,52.13 65.34,50.33 U13.5 67.17,50.31 69.38,48.09 RV20.1 RV21.1 | 68.07,59.94 72.48,59.94 72.98,60.45 72.98,62.06 73.91,62.99 75.56,62.99 76.07,63.5 76.07,65.66 76.44,66.03 C17.1 79.38,66.03 79.73,65.67 79.73,63.08 80.6,62.2 81.83,62.2 85.65,66.03 86.28,66.03 U24.3 87.06,66.04 87.61,65.5 87.61,60.81 | 68.07,59.94 64.9,59.94 | 68.07,59.94 68.07,56.68 RV17.1 RV18.1 | U17.5 93.7,60.83 | 93.7,60.83 87.63,60.83 87.61,60.81 | 87.12,44.7 86.61,44.7 85.98,45.34 85.98,47.88 86.87,48.77
  Top 0.508: 87.12,44.7 88.9,44.7 89.79,45.59 | U18.5 96.48,51.35 95.89,51.94 89.03,51.94 88.42,52.55 | RV9.1 38.65,36.83 38.52,36.83 | 55.75,43.69 62.96,43.69 U14.5 67.8,41.29 69.38,39.71 RV23.1 RV24.1 | U19.5 96.6,42.5 95.8,43.31 92.08,43.31 89.79,45.59 | 87.12,44.7 87.12,40.51 87.76,39.88 U10.7 87,39.88 85.34,38.23 85.34,36.2 86.32,35.22 86.32,35.14 | 38.52,36.83 37.38,35.69 37.34,35.69 37.08,35.43 37.08,31.5 37.85,30.73 RV11.1 | RV11.1 RV12.1 36.96,26.63 36.96,22.61 | C14.1 29.58,42.02 29.21,41.66 29.21,38.61 29.84,37.97 30.75,37.97 C16.1 32.91,38.09 34.16,36.83 38.52,36.83 | RV11.1 37.53,29.62 U22.2 | RV15.1 RV14.1 37.72,21.84 36.96,22.61 | 56.26,27.18 55.12,28.32 55.12,30.1 56.52,31.5 | 56.26,27.18 58.67,27.18 | C7.1 60.44,29.97 59.69,29.97 59.31,29.59 59.31,27.81 58.67,27.18 | 56.26,27.18 55.5,26.42 55.5,24.38 56.77,23.11 U7.7 56.32,23.11 55.37,22.16 55.37,19.94 56.26,19.05 58.29,19.05 59.31,20.07 59.31,21.59 59.56,21.84 60.57,21.84 C8.1 | RV27.1 RV26.1 66.83,33.03 U15.5 64.51,33.03 63.19,34.36 55.63,34.36 | 58.67,27.18 59.31,26.54 63.88,26.54 65.36,25.06 U16.5 66.66,25.03 69.34,22.35 RV29.1 RV30.1 | 86.29,31.37 86.32,31.39 86.32,35.14 | 86.29,31.37 85.34,30.42 85.34,28.57 86.61,27.3 | C12.1 90.41,30.09 89.53,29.21 89.53,27.3 | 86.61,27.3 89.53,27.3 | C13.1 91.43,21.21 89.92,21.21 89.92,19.43 89.15,18.67 86.23,18.67 85.6,19.3 85.6,21.66 87.06,23.11 U12.7 87.5,23.11 85.85,24.77 85.85,26.54 86.61,27.3 | U21.5 96.73,24.93 95.89,25.78 91.06,25.78 89.53,27.3 | J6.1 107.08,69.84 106.51,69.26 103.8,69.26 100.39,65.85 | 100.39,65.85 95.38,60.83 93.7,60.83 | 100.39,65.85 100.52,65.85 107.81,58.56 107.81,50.91 108.18,50.91 J3.1
  Top 0.508: J4.1 107.68,28.4 107.68,31.73 106.14,33.27 96.49,33.27 U20.5 96.48,33.95 95.38,35.05 89.79,35.05 88.9,35.94 | 36.96,22.61 32.51,22.61 19.3,9.4 11.68,9.4 4.83,16.26 A1.VIN | 56.1,35.78 56.16,35.84 55.09,36.92 55.09,38.71 56.39,40.01 | 56.52,31.5 55.63,32.38 55.63,34.36 | 56.52,31.5 56.64,31.37 U6.7 | 55.5,56.77 54.74,57.53 54.74,60.71 56.64,62.61 | 56.39,40.01 55.75,40.64 55.75,43.69 | 56.39,40.01 56.52,39.88 U5.7 | 56.1,35.78 57.56,35.78 60,38.22 C6.1 | 55.75,44.96 55.75,43.69 | C10.1 90.28,47.49 89.79,46.99 89.79,45.59 | 88.9,35.94 89.66,36.7 89.66,37.59 90.28,38.22 C11.1 | 88.9,35.94 87.12,35.94 86.32,35.14 | 87.61,60.81 86.49,59.69 86.49,57.15 87.06,56.58 | 86.87,48.77 U9.7 | 87.06,56.58 87.12,56.52 87.1,56.52 85.95,55.37 85.95,53.43 86.83,52.55 | 87.06,56.58 88.27,56.58 U8.7 | 55.5,56.77 U3.7 | 56.1,35.78 55.63,35.31 55.63,34.36 | 86.83,52.55 86.83,48.81 86.87,48.77 | U11.7 86.29,31.37 | 88.42,52.55 86.83,52.55 | C9.1 90.61,54.73 88.42,52.55
+24V
  Top 0.508: J2.1 32.66,69.32 33.02,68.96 49.78,68.96 50.93,67.82 U1.2 50.93,66.29 51.44,65.79 54.49,65.79 C1.1
CAN_TT_RX  (via drill 0.35)
  Top 0.254: U24.4 87.76,67.31 v88.27,66.8 | v93.73,61.7 v93.72,61.7 89.94,61.7 v88.77,62.87 | v99.06,57.15 100.58,57.15 101.73,56.01 101.73,37.97 v102.36,37.34 | v101.73,20.19 101.73,11.43 98.93,8.64 v98.87,8.7
  Bottom 0.254: v88.27,66.8 88.77,66.29 v88.77,62.87 | v93.73,61.7 94.51,61.7 v99.06,57.15 | v102.36,37.34 102.36,20.83 v101.73,20.19 | v98.87,8.7 98.74,8.83 24.07,8.83 8.89,24 A1.D23
CAN_TT_TX  (via drill 0.35)
  Top 0.254: U24.1 86.3,61.91 v86.23,61.85 | v97.54,52.83 100.84,49.53 v100.84,35.69 | v100.84,29.84 100.84,12.19 v98.81,10.16
  Bottom 0.254: v97.54,52.83 94.87,52.83 86.23,61.47 v86.23,61.85 | v100.84,35.69 v100.84,29.84 | v98.81,10.16 24.26,10.16 7.87,26.54 A1.D22
CANH  (via drill 0.35)
  Top 0.254: v97.22,69.28 96.84,69.66 83.88,69.66 v83.82,69.72 | v82.42,66.29 82.42,65.02 82.17,64.77 U24.7 | v104.14,67.31 106.77,67.31 J6.3
  Bottom 0.254: v104.14,67.31 99.19,67.31 v97.22,69.28 | v83.82,69.72 82.42,68.33 v82.42,66.29
CANL  (via drill 0.35)
  Top 0.254: J6.4 108.58,68.49 108.58,73.15 107.82,73.91 106.34,73.91 104.71,72.29 96.29,72.29 94.87,70.87 v82.68,70.87 | v79.99,67.03 80.98,66.04 U24.6
  Bottom 0.254: v82.68,70.87 79.99,68.18 v79.99,67.03
GND  (via drill 0.35)
  other vias: 86.61,29.59 56.26,29.08 87,46.74 56.26,20.83 56.13,37.34 86.74,20.7 76.83,61.72 56.13,46.48 86.87,54.36 92.84,53.34 29.72,45.97 32.89,41.91 24.77,48.51 26.04,39.24 84.84,63.63 61.85,54.61 55.88,54.99 92.71,38.23 86.61,37.47 53.34,64.26
  pour Top: -0.51,-0.51 -0.51,85.34 122.43,85.34 122.43,-0.51
  pour Bottom: -1.27,-1.27 -1.27,86.11 123.19,86.11 123.19,-1.27
N$1  (via drill 0.35)
  Top 0.254: R2.2 60.54,49.02 60.29,49.28 v59.18,49.28 | U4.1 54.86,50.04 55.48,49.43 v55.48,49.4
  Bottom 0.254: v55.48,49.4 59.05,49.4 v59.18,49.28
N$2  (via drill 0.35)
  Top 0.254: U3.1 52.69,58.04 v53.7,57.03 | v59.05,56.9 60.41,56.9 R1.2
  Bottom 0.254: v53.7,57.03 53.84,56.9 v59.05,56.9
N$3
  Top 0.254: R1.1 59.27,58.63 58.67,58.04 U3.8
N$4
  Top 0.254: U4.8 58.67,50.04 59.44,50.8 60.54,50.8 R2.1
N$5  (via drill 0.35)
  Top 0.254: U5.1 v54.48,41.15 | R3.2 60.36,40.01 v59.18,40.01
  Bottom 0.254: v54.48,41.15 55.63,40.01 v59.18,40.01
N$6  (via drill 0.35)
  Top 0.254: v84.58,56.77 83.31,58.04 U8.1 | v89.66,56.77 91.35,56.77 R6.2
  Bottom 0.254: v84.58,56.77 v89.66,56.77
N$7
  Top 0.254: R3.1 60.41,41.66 59.56,41.66 59.05,41.15 U5.8
N$8
  Top 0.254: R6.1 90.26,58.38 89.53,57.66 88.46,57.66 U8.8
N$9  (via drill 0.35)
  Top 0.254: R4.2 59.27,31.41 v59.18,31.5 | v54.36,32 53.72,32.64 U6.1
  Bottom 0.254: v59.18,31.5 54.86,31.5 v54.36,32
N$10  (via drill 0.35)
  Top 0.254: U9.1 83.71,50.04 83.7,50.03 v84.45,49.28 | R7.2 91.35,49.28 v90.04,49.28
  Bottom 0.254: v90.04,49.28 v84.45,49.28
N$11
  Top 0.254: R4.1 60.49,33.02 59.44,33.02 58.93,32.51 57.98,32.51 U6.8
N$12  (via drill 0.35)
  Top 0.254: U7.1 53.98,24.38 v54.61,23.75 | v59.31,23.73 60.39,23.73 R5.2
  Bottom 0.254: v54.61,23.75 59.29,23.75 v59.31,23.73
N$13
  Top 0.254: U7.8 59.05,24.38 59.91,25.23 R5.1
N$14
  Top 0.254: U9.8 89.03,50.04 89.88,50.89 R7.1
N$15  (via drill 0.35)
  Top 0.254: U10.1 84.07,41.15 v84.71,40.51 | v89.92,40.01 90,39.92 R8.2
  Bottom 0.254: v84.71,40.51 89.41,40.51 v89.92,40.01
N$16
  Top 0.254: R8.1 91.15,41.78 90.3,41.78 89.66,41.15 U10.8
N$17  (via drill 0.35)
  Top 0.254: U11.1 84.07,32.64 84.45,32.26 v85.22,32.26 | v89.92,31.75 89.95,31.79 R9.2
  Bottom 0.254: v85.22,32.26 89.41,32.26 v89.92,31.75
N$18
  Top 0.254: U11.8 89.28,32.64 90.17,33.53 91.27,33.53 R9.1
N$19  (via drill 0.35)
  Top 0.254: U12.1 84.07,24.38 v84.96,23.5 | v90.17,22.86 90.21,22.9 R10.2
  Bottom 0.254: v84.96,23.5 89.53,23.5 v90.17,22.86
N$20
  Top 0.254: R10.1 91.53,24.64 90.04,24.64 89.79,24.38 U12.8
N$21
  Top 0.254: U13.3 63.16,47.42 R22.1 63.33,47.24 R12.2
N$22
  Top 0.254: R11.2 63.21,55.37 R21.1 63.12,57.3 U23.3
N$23
  Top 0.254: U14.3 63.16,38.23 R23.1 65.23,38.19 R13.2
N$24
  Top 0.254: U15.3 63.25,31.65 R24.1 65.48,29.93 R14.2
N$25
  Top 0.254: U16.3 63.16,21.98 R25.1 65.36,21.93 R15.2
N$26
  Top 0.254: U17.3 94.49,56.54 R17.1 96.98,54.7 R16.2
N$27
  Top 0.254: R18.2 96.72,47.59 R19.1 94.49,49.18 U18.3
N$28
  Top 0.254: U19.3 94.4,38.36 R26.1 96.72,38.31 R20.2
N$29
  Top 0.254: U20.3 94.11,31.82 R28.1 96.47,29.93 R27.2
N$30
  Top 0.254: U21.3 94.53,21.09 R30.1 96.77,21.04 R29.2
N$41
  Top 0.254: RV2.1 VR1.1
N$42
  Top 0.254: RV3.2 43.43,56.01 VR1.3
N$44
  Top 0.254: RV1.1 VR2.1
N$45
  Top 0.254: VR2.3 44.2,45.09 41.66,47.62 RV5.2
N$46
  Top 0.254: RV11.2 43.18,30.73 VR4.3
N$47
  Top 0.254: RV7.1 45.59,41.53 VR3.1
N$48
  Top 0.254: RV8.2 41.53,39.24 44.2,36.58 VR3.3
N$49
  Top 0.254: RV10.1 VR4.1
N$50
  Top 0.254: RV14.2 43.43,21.84 VR5.3
N$51
  Top 0.254: RV13.1 45.59,24.77 VR5.1
N$52
  Top 0.254: RV16.1 VR6.1
N$53
  Top 0.254: RV17.2 72.77,55.88 74.95,53.7 75.02,53.72 VR6.3
N$54
  Top 0.254: VR7.1 RV19.1
N$55
  Top 0.254: RV20.2 72.64,47.37 74.93,45.09 VR7.3
N$56
  Top 0.254: RV22.1 75.95,41.91 VR8.1
N$57
  Top 0.254: RV23.2 73.41,39.24 VR8.3
N$58
  Top 0.254: RV25.1 VR9.1
N$59
  Top 0.254: RV26.2 73.76,30.73 VR9.3
N$60
  Top 0.254: RV28.1 VR10.1
N$61
  Top 0.254: RV29.2 74.17,21.84 76.45,19.56 VR10.3
OUT1+  (via drill 0.35)
  Top 0.254: U3.3 50.04,55.5 46.61,52.07 41.15,52.07 40.35,52.87 RV4.2 41.78,53.59 v42.55,54.36
  Bottom 0.254: v42.55,54.36 42.55,64.01 51.18,72.64 51.18,74.45 J5.5
OUT1-
  Top 0.254: U3.2 51.44,56.77 50.93,56.26 VR1.2
OUT2+  (via drill 0.35)
  Top 0.254: RV6.2 41.11,45.09 42,44.2 47.75,44.2 51.05,47.5 U4.3 53.09,47.5 v53.85,48.26
  Bottom 0.254: v53.85,48.26 53.85,52.32 53.21,52.96 51.44,52.96 50.55,53.85 50.55,59.82 51.56,60.83 53.09,60.83 54.1,61.85 54.1,74.42 J5.4
OUT2-
  Top 0.254: U4.2 50.93,48.77 49.78,47.62 49.78,47.5 48.39,47.5 VR2.2
OUT3+  (via drill 0.35)
  Top 0.254: RV9.2 41.78,36.7 43.05,35.43 48.01,35.43 51.18,38.61 | 51.18,38.61 U5.3 | 51.18,38.61 v50.5,39.29 | v53.85,44.32 51.31,44.32 50.55,43.56 v50.55,41.53 | v73.28,68.58 73.28,71.88 75.87,74.47 J1.5
  Bottom 0.254: v73.28,68.58 75.06,66.8 75.06,55.75 63.63,44.32 v53.85,44.32 | v50.5,39.29 50.5,41.49 v50.55,41.53
OUT3-
  Top 0.254: VR3.2 49.15,39.12 50.04,40.01 52.39,40.01 U5.2
OUT4+  (via drill 0.35)
  Top 0.254: RV12.2 41.62,26.92 47.62,26.92 50.8,30.1 U6.3 52.06,30.1 50.8,28.84 v50.8,24.13 | v99.57,24.89 99.57,31.24 v99.82,31.5 | J1.4 81.46,70.31 83.06,68.71 88.27,68.71 89.72,67.25 89.72,63.56 90.81,62.48 v95.25,62.48 | v51.82,18.29 52.32,17.78 v68.58,17.78
  Bottom 0.254: v99.57,24.89 99.57,20.07 97.28,17.78 v68.58,17.78 | v50.8,24.13 50.8,19.3 v51.82,18.29 | v95.25,62.48 99.82,57.91 v99.82,31.5
OUT4-
  Top 0.254: VR4.2 50.55,30.73 51.18,31.37 U6.2
OUT5+  (via drill 0.35)
  Top 0.254: U7.3 51.44,21.84 47.62,18.03 41.4,18.03 41.4,18.12 RV15.2 40.47,14.64 40.89,14.22 v43.69,14.22
  Bottom 0.254: J1.3 84.45,71.5 85.6,70.36 87.88,70.36 90.68,67.56 90.68,64.64 91.82,63.5 96.52,63.5 103.38,56.64 103.38,19.56 98.04,14.22 v43.69,14.22
OUT5-
  Top 0.254: VR5.2 49.78,22.1 50.8,23.11 U7.2
OUT6+  (via drill 0.35)
  Top 0.254: v78.99,62.36 78.99,62.23 80.14,61.09 84.33,61.09 85.6,59.82 85.6,56.13 84.96,55.5 U8.3 81.92,55.24 78.61,51.94 72.77,51.94 71.88,52.83 RV18.2 | J5.1 63.2,74.42 67.94,74.42 69.22,73.15 69.22,70.36 69.85,69.72 v70.1,69.72
  Bottom 0.254: v78.99,62.36 78.99,69.22 78.49,69.72 v70.1,69.72
OUT6-
  Top 0.254: U8.2 81.53,56.52 80.9,55.88 VR6.2
OUT7+  (via drill 0.35)
  Top 0.254: v71.75,61.21 71.25,61.72 69.6,61.72 68.71,62.61 68.71,63.75 67.94,64.52 v66.29,64.52 | v60.71,69.85 61.34,70.48 61.34,73.28 J5.2 | v76.2,56.77 76.07,56.64 v73.41,56.64 | RV21.2 72.14,44.7 73.03,43.81 78.47,43.81 82.12,47.47 82.96,47.47 U9.3 84.2,47.5 85.72,49.02 85.72,50.29 84.07,51.94 v81.03,51.94
  Bottom 0.254: v66.29,64.52 65.66,65.15 61.72,65.15 60.71,66.17 v60.71,69.85 | v81.03,51.94 v76.2,56.77 | v71.75,61.21 71.75,58.29 v73.41,56.64
OUT7-
  Top 0.254: VR7.2 80.26,48.77 U9.2
OUT8+  (via drill 0.35)
  Top 0.254: RV24.2 72.35,36.7 73.57,35.49 78.54,35.49 81.66,38.61 U10.3 84.26,38.61 85.75,40.09 85.75,43.92 84.71,44.96 v81.79,44.96 | v79.38,50.55 78.51,51.41 72.73,51.41 72.7,51.44 69.09,51.44 v68.07,52.45 | v59.69,61.98 57.15,64.52 v57.15,64.64
  Bottom 0.254: v81.79,44.96 80.46,46.28 80.46,47.97 79.38,49.06 v79.38,50.55 | v68.07,52.45 68.22,52.6 68.22,53.48 59.73,61.98 v59.69,61.98 | J5.3 v57.15,64.64
OUT8-
  Top 0.254: VR8.2 80.01,39.88 U10.2
OUT9+  (via drill 0.35)
  Top 0.254: RV27.2 72.9,28.19 74.3,26.8 77.6,26.8 80.9,30.1 U11.3 82.39,29.87 82.31,29.87 81.53,29.1 v81.53,26.16 | v81.66,19.18 81.66,12.45 82.3,11.81 v93.34,11.81
  Bottom 0.254: v93.34,11.81 99.31,11.81 105.54,18.03 105.54,59.38 J1.1 | v81.53,26.16 81.53,19.3 v81.66,19.18
OUT9-
  Top 0.254: U11.2 79.76,31.37 VR9.2
OUT10+  (via drill 0.35)
  Top 0.254: U12.3 80.9,21.84 77.34,18.29 74.04,18.29 73.28,19.05 RV30.2 71.21,13.63 71.88,12.95 v73.28,12.95
  Bottom 0.254: v73.28,12.95 98.55,12.95 104.52,18.92 104.52,57.47 97.58,64.41 93.07,64.41 91.44,66.04 91.44,67.94 87.45,71.93 J1.2
OUT10-
  Top 0.254: VR10.2 79.8,23.11 U12.2
STRAIN_GAUGE1_AMPLIFIED  (via drill 0.35)
  Top 0.254: U23.4 66.28,57.39 66.29,57.4 67.14,56.55 R11.1 67.14,53.68 v67.06,53.59 | v55.5,51.82 v51.69,51.82 | v33.78,48.64 32.82,47.68 U2.4
  Bottom 0.254: v67.06,53.59 67.06,52.7 66.17,51.82 v55.5,51.82 | v51.69,51.82 49.66,51.82 46.48,48.64 v33.78,48.64
STRAIN_GAUGE1_INTER
  Top 0.254: U3.6 58.67,55.5 59.31,56.13 61.47,56.13 61.72,56.39 61.72,58.42 61.99,58.69 U23.1
STRAIN_GAUGE2_AMPLIFIED  (via drill 0.35)
  Top 0.254: U2.5 31.71,48.19 30.59,48.19 28.81,46.4 28.81,44.81 30.46,43.16 35.79,43.16 v35.81,43.18 | U13.4 66.44,49.01 67.4,48.05 R12.1 67.4,45.43 v66.8,44.83
  Bottom 0.254: v66.8,44.83 65.15,43.18 v35.81,43.18
STRAIN_GAUGE2_INTER
  Top 0.254: U4.6 58.67,47.5 59.31,48.13 61.34,48.13 61.85,48.64 61.85,49.91 62.23,50.29 63.15,50.29 U13.1
STRAIN_GAUGE3_AMPLIFIED  (via drill 0.35)
  Top 0.254: v67.18,36.45 67.14,36.49 R13.1 67.14,39.28 66.42,40.01 66.41,39.99 U14.4 | v34.29,38.86 v34.29,41.66 | U2.6 31.84,49 29.82,49 v29.72,48.9
  Bottom 0.254: v67.18,36.45 66.42,35.69 60.58,35.69 58.24,38.03 35.12,38.03 v34.29,38.86 | v34.29,41.66 34.29,43.69 33.66,44.32 31.11,44.32 30.48,44.96 30.48,47.37 29.72,48.13 v29.72,48.9
STRAIN_GAUGE3_INTER
  Top 0.254: U5.6 57.72,38.48 58.93,38.48 59.51,39.06 61.22,39.06 61.85,39.69 61.85,40.89 62.24,41.29 U14.1
STRAIN_GAUGE4_AMPLIFIED  (via drill 0.35)
  Top 0.254: U15.4 66.69,31.73 67.44,30.99 67.44,29.76 R14.1 67.4,27.98 v67.44,27.94 | v22.86,29.08 22.86,30.99 24.77,32.89 26.41,32.89 U22.10
  Bottom 0.254: v67.44,27.94 65.91,26.42 25.53,26.42 v22.86,29.08
STRAIN_GAUGE4_INTER
  Top 0.254: U6.6 57.98,30.23 59.18,30.23 59.63,30.68 61.41,30.68 61.98,31.24 61.98,32.64 62.37,33.03 U15.1
STRAIN_GAUGE5_AMPLIFIED  (via drill 0.35)
  Top 0.254: U16.4 65.38,23.75 66.29,23.75 67.06,22.99 67.06,21.93 R15.1 67.14,19.01 v67.06,18.92 | U22.11 26.29,32.07 25.29,32.07 23.62,30.41 23.62,26.04 v26.04,23.62
  Bottom 0.254: v67.06,18.92 65.46,17.33 32.33,17.33 v26.04,23.62
STRAIN_GAUGE5_INTER
  Top 0.254: U7.6 58.31,21.84 59.2,22.73 61.47,22.73 61.98,23.24 61.98,24.64 62.36,25.02 63.15,25.02 U16.1
STRAIN_GAUGE6_AMPLIFIED  (via drill 0.35)
  Top 0.254: v98.81,52.83 98.77,52.87 R16.1 98.77,55.92 97.93,56.75 U17.4 | U2.9 26.3,50.29 24.26,50.29 22.86,48.9 22.86,46.74 22.35,46.23 v22.35,44.83
  Bottom 0.254: v22.35,44.83 22.35,43.43 25.65,40.13 46.61,40.13 48.77,42.29 65.41,42.29 66.42,43.31 90.68,43.31 98.81,51.44 v98.81,52.83
STRAIN_GAUGE6_INTER
  Top 0.254: U8.6 89.66,55.24 90.17,55.75 92.08,55.75 92.96,56.64 92.96,57.66 93.36,58.05 U17.1
STRAIN_GAUGE7_AMPLIFIED  (via drill 0.35)
  Top 0.254: v98.55,44.7 98.64,44.7 R18.1 98.64,48.55 97.81,49.39 U18.4 | v22.23,38.73 22.23,42.55 23.37,43.69 23.37,48.58 24.4,49.61 26.29,49.61 U2.10
  Bottom 0.254: v98.55,44.7 97.92,44.07 97.92,42.16 90.73,34.98 25.98,34.98 v22.23,38.73
STRAIN_GAUGE7_INTER
  Top 0.254: U18.1 93.49,50.69 93.09,50.29 93.09,49.15 92.27,48.33 89.99,48.33 89.53,47.88 U9.6
STRAIN_GAUGE8_AMPLIFIED  (via drill 0.35)
  Top 0.254: U19.4 97.93,39.99 98.55,39.37 98.55,38.27 R20.1 98.51,35.85 v98.55,35.81 | v21.57,32.41 21.57,46.97 22.07,47.48 v22.07,48.49 | v26.42,52.83 27.43,51.82 27.43,49.23 27.2,49 26.33,49 U2.11
  Bottom 0.254: v98.55,35.81 96.97,34.23 75.22,34.23 74.77,33.78 48.3,33.78 41.69,27.18 26.8,27.18 v21.57,32.41 | v22.07,48.49 22.07,51.41 23.5,52.83 v26.42,52.83
STRAIN_GAUGE8_INTER
  Top 0.254: U10.6 89.53,38.61 90.04,39.12 92.58,39.12 93.09,39.62 93.09,40.77 93.61,41.29 U19.1
STRAIN_GAUGE9_AMPLIFIED  (via drill 0.35)
  Top 0.254: U20.4 96.49,32 97.54,32 98.3,31.24 98.3,29.88 R27.1 98.26,27.98 v98.55,27.69 | U22.4 31.84,30.77 31.09,30.77 29.97,29.65 v29.97,24.51 | v37.34,16.26 34.8,18.8 v34.67,18.8
  Bottom 0.254: v98.55,27.69 100.33,25.91 100.33,19.43 97.16,16.26 v37.34,16.26 | v34.67,18.8 29.97,23.5 v29.97,24.51
STRAIN_GAUGE9_INTER
  Top 0.254: U11.6 89.54,30.1 90.43,30.99 92.33,30.99 92.91,31.57 92.91,32.59 93.6,33.27 94.26,33.27 U20.1
STRAIN_GAUGE10_AMPLIFIED  (via drill 0.35)
  Top 0.254: v97.16,15.24 98.51,16.6 R29.1 98.51,22.14 97.55,23.1 U21.4 | U22.5 31.84,31.42 30.84,31.42 28.07,28.65 28.07,23.37 v26.42,21.72
  Bottom 0.254: v97.16,15.24 32.89,15.24 v26.42,21.72
STRAIN_GAUGE10_INTER
  Top 0.254: U21.1 93.74,24.4 93.22,23.88 93.22,22.99 92.08,21.84 U12.6
SURREY_RX1  (via drill 0.35)
  Top 0.254: J3.3 105.94,50.65 106.43,50.16 106.43,34.42 108.46,32.38 108.46,31.24 110.49,29.21 110.49,24.13 109.22,22.86 109.22,17.4 v99.06,7.24 | v29.21,12.32 30.48,11.05 30.48,7.87 31.11,7.24 v32.77,7.24
  Bottom 0.254: v29.21,12.32 29.08,12.32 20.07,21.34 A1.D1 | v99.06,7.24 v32.77,7.24
SURREY_RX2  (via drill 0.35)
  Top 0.254: J4.3 104.84,28.17 106.3,26.71 106.3,16.64 v105.03,15.37 | v16,12.95 16,35.18 A1.D8
  Bottom 0.254: v105.03,15.37 105.03,7.49 100.71,3.17 25.78,3.17 v16,12.95
SURREY_TX1  (via drill 0.35)
  Top 0.254: J3.2 107.94,47.65 107.56,47.27 107.56,42.3 115.57,34.29 115.57,19.56 101.73,5.71 v101.47,5.71 | v27.69,11.3 v27.69,7.62
  Bottom 0.254: v27.69,7.62 29.59,5.71 v101.47,5.71 | v27.69,11.3 A1.D0
SURREY_TX2  (via drill 0.35)
  Top 0.254: J4.2 107.68,25.17 107.68,23.51 v107.7,23.5 | v104.52,5.08 104.01,4.57 v98.81,4.57 | v17.65,13.46 16.76,14.35 16.76,34.67 18.8,36.7 A1.D7
  Bottom 0.254: v107.7,23.5 107.7,8.26 v104.52,5.08 | v98.81,4.57 26.54,4.57 v17.65,13.46
TT_CLK  (via drill 0.35)
  Top 0.254: U2.16 26.31,43.71 v23.73,41.13 | U22.16 26.43,26.31 v25.65,25.53
  Bottom 0.254: v25.65,25.53 25.55,25.42 23.22,25.42 20.83,27.81 15.49,27.81 5.97,37.34 5.97,48.26 | 5.97,48.26 13.74,40.49 23.09,40.49 v23.73,41.13 | 5.97,48.26 A1.D13
TT_SDI  (via drill 0.35)
  Top 0.254: U2.15 26.16,46.23 25.67,46.23 25.17,45.74 25.17,43.94 v25.3,43.81 | v28.47,43.18 28.47,39.27 v28.19,38.99 | v25.78,37.21 25.78,36.32 23.54,34.08 23.54,33.57 v23.37,33.4 | v24.77,30.48 25.63,29.62 U22.15 | A1.D12 16.51,45.85 v16.51,38.1
  Bottom 0.254: v25.3,43.81 25.93,43.18 v28.47,43.18 | v28.19,38.99 27.56,38.99 v25.78,37.21 | v24.77,30.48 24.77,32 v23.37,33.4 23.19,33.4 21.26,35.33 18.52,35.33 16.51,37.34 v16.51,38.1
TT_SDO  (via drill 0.35)
  Top 0.254: v23.24,36.07 22.99,36.32 22.99,41.66 24.51,43.18 24.51,45.73 25.67,46.88 26.16,46.88 U2.14 26.21,47.13 24.37,47.13 v24.26,47.24 | v28.11,30.31 28.07,30.27 U22.14 | v22.86,50.67 20.07,47.88 A1.D11
  Bottom 0.254: v23.24,36.07 25.02,34.29 27.3,34.29 29.08,32.51 29.08,31.27 v28.11,30.31 | v24.26,47.24 23.88,47.62 23.88,49.66 v22.86,50.67